# Altium project Controller-RK3562.PrjPcb (part 1 of 8)
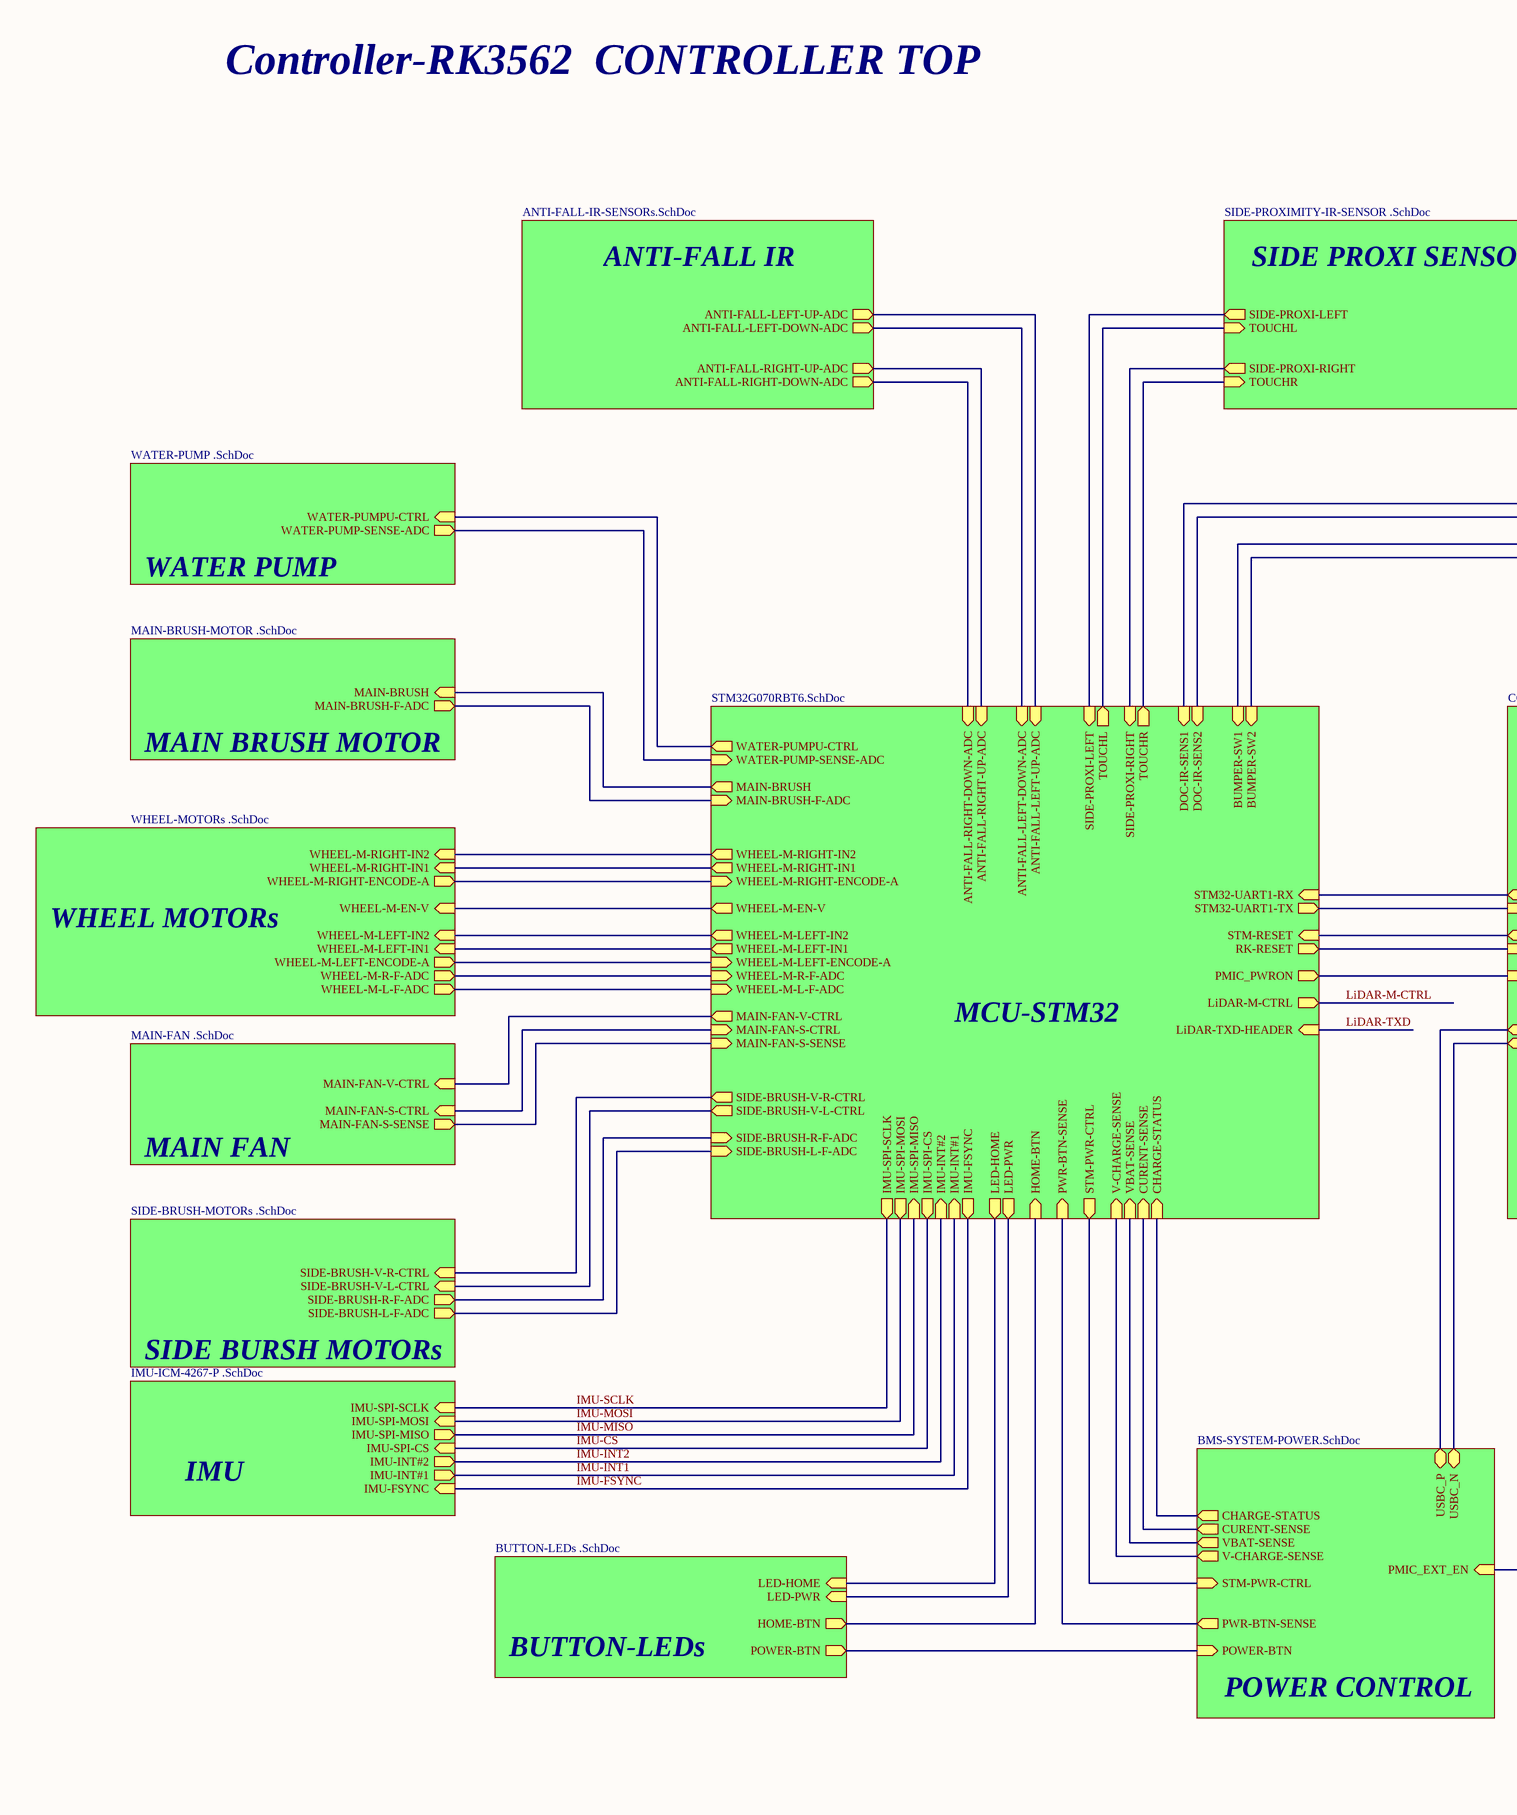
[diagram p0: Controller-RK3562-TOP.SchDoc, left]
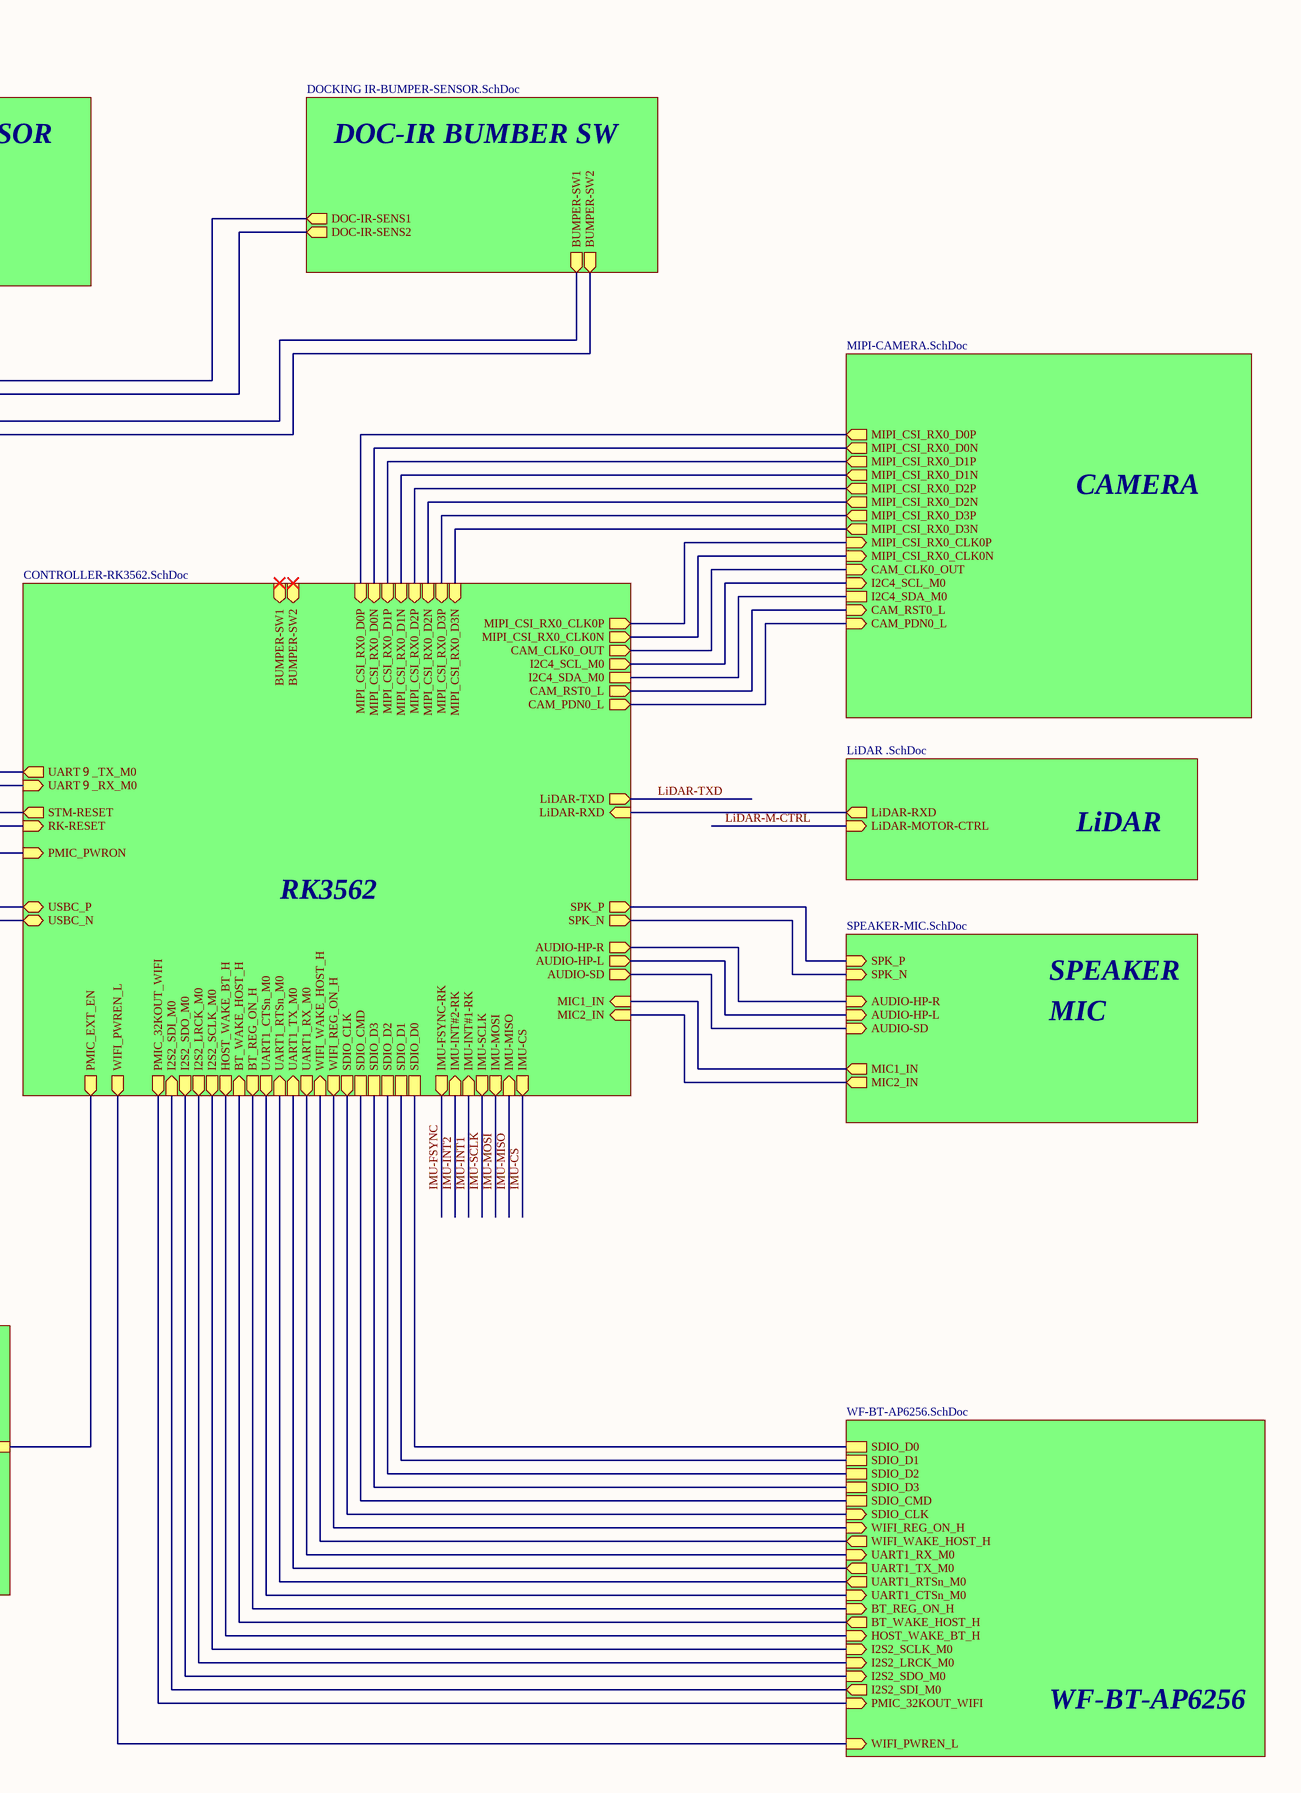
[diagram p1: Controller-RK3562-TOP.SchDoc, right]
32 sheets, 693 parts. Net scope: hierarchical (ports join the sheet entries above them; power ports are global).
Board file: Controller-RK3562-PCB.PcbDoc
Sheets:
  Controller-RK3562-TOP.SchDoc
    RK3562 = CONTROLLER-RK3562.SchDoc
      eMMC = eMMC.SchDoc
      RK3562-POWER = RK3562-POWER-GND.SchDoc
      RK3562-DDR-PHY = RK3562-DDR-PHY.SchDoc
      RK3562-PMUIO-OSC-PLL = RK3562-PMUIO-OSC-PLL.SchDoc
      RK3562-VCCIO1 = RK3562-VCCIO1.SchDoc
      RK3562-VCCIO2-VCCIO3 = RK3562-VCCIO2-VCCIO3.SchDoc
      RK3562-VCCIO4 = RK3562-VCCIO4.SchDoc
      RK3562-VCCIO5 = RK3562-VCCIO5.SchDoc
      RK3562-VCCIO6 = RK3562-VCCIO6.SchDoc
      RK3562-USB-PCIe-PHY = RK3562-USB-PCIe-PHY.SchDoc
      DRAM-LPDDR4 = DDR-LPDDR4.SchDoc
      SD/TF CARD = SD_TF-CARD.SchDoc
      RK-POWER-SUPPLY = RK-POWER-SUPPLY.SchDoc
      RK-PERIPHERAL-POWER = RK-PERIPHERAL-POWER.SchDoc
    POWER = BMS-SYSTEM-POWER.SchDoc
    DOCKING-BUMBER = DOCKING IR-BUMPER-SENSOR.SchDoc
    ANTI-FALL = ANTI-FALL-IR-SENSORs.SchDoc
    SIDE-PROXI = SIDE-PROXIMITY-IR-SENSOR .SchDoc
    WATER-PUMP = WATER-PUMP .SchDoc
    MAIN-BRUSH MOTOR = MAIN-BRUSH-MOTOR .SchDoc
    WHEEL MOTOR = WHEEL-MOTORs .SchDoc
    MAIN-FAN = MAIN-FAN .SchDoc
    SIDE-BRUSH = SIDE-BRUSH-MOTORs .SchDoc
    LiDAR = LiDAR .SchDoc
    SPEAKER-MIC = SPEAKER-MIC.SchDoc
    BUTTON-LED = BUTTON-LEDs .SchDoc
    CAMERA = MIPI-CAMERA.SchDoc
    MCU-STM32 = STM32G070RBT6.SchDoc
    WIFI-BT = WF-BT-AP6256.SchDoc
    IMU = IMU-ICM-4267-P .SchDoc

## Sheet Controller-RK3562-TOP.SchDoc
size A2; SheetNumber: 1; SheetTotal: 32

### Sub-sheets
ANTI-FALL = ANTI-FALL-IR-SENSORs.SchDoc: ANTI-FALL-LEFT-UP-ADC (out), ANTI-FALL-LEFT-DOWN-ADC (out), ANTI-FALL-RIGHT-UP-ADC (out), ANTI-FALL-RIGHT-DOWN-ADC (out)
BUTTON-LED = BUTTON-LEDs .SchDoc: LED-HOME (in), LED-PWR (in), HOME-BTN (out), POWER-BTN (out)
CAMERA = MIPI-CAMERA.SchDoc: MIPI_CSI_RX0_D0P (out), MIPI_CSI_RX0_D0N (out), MIPI_CSI_RX0_D1P (out), MIPI_CSI_RX0_D1N (out), MIPI_CSI_RX0_D2P (out), MIPI_CSI_RX0_D2N (out), MIPI_CSI_RX0_D3P (out), MIPI_CSI_RX0_D3N (out), CAM_CLK0_OUT (in), I2C4_SCL_M0 (in), I2C4_SDA_M0, CAM_RST0_L (in), CAM_PDN0_L (in), MIPI_CSI_RX0_CLK0P (in), MIPI_CSI_RX0_CLK0N (in)
DOCKING-BUMBER = DOCKING IR-BUMPER-SENSOR.SchDoc: DOC-IR-SENS1 (out), DOC-IR-SENS2 (out), BUMPER-SW1 (out), BUMPER-SW2 (out)
IMU = IMU-ICM-4267-P .SchDoc: IMU-SPI-SCLK (in), IMU-SPI-MOSI (in), IMU-SPI-MISO (out), IMU-SPI-CS (in), IMU-INT#2 (out), IMU-INT#1 (out), IMU-FSYNC (in)
LiDAR = LiDAR .SchDoc: LiDAR-MOTOR-CTRL (in), LiDAR-RXD (out)
MAIN-BRUSH MOTOR = MAIN-BRUSH-MOTOR .SchDoc: MAIN-BRUSH (in), MAIN-BRUSH-F-ADC (out)
MAIN-FAN = MAIN-FAN .SchDoc: MAIN-FAN-V-CTRL (in), MAIN-FAN-S-CTRL (in), MAIN-FAN-S-SENSE (out)
MCU-STM32 = STM32G070RBT6.SchDoc: WATER-PUMPU-CTRL (out), MAIN-BRUSH (out), WHEEL-M-RIGHT-IN2 (out), WHEEL-M-RIGHT-IN1 (out), WHEEL-M-RIGHT-ENCODE-A (in), WHEEL-M-LEFT-IN2 (out), WHEEL-M-LEFT-IN1 (out), WHEEL-M-LEFT-ENCODE-A (in), WHEEL-M-EN-V (out), MAIN-FAN-V-CTRL (out), MAIN-FAN-S-CTRL (in), MAIN-FAN-S-SENSE (in), SIDE-BRUSH-V-R-CTRL (out), SIDE-BRUSH-V-L-CTRL (out), DOC-IR-SENS1 (in), DOC-IR-SENS2 (in), ANTI-FALL-LEFT-UP-ADC (in), ANTI-FALL-LEFT-DOWN-ADC (in), ANTI-FALL-RIGHT-UP-ADC (in), ANTI-FALL-RIGHT-DOWN-ADC (in), SIDE-PROXI-LEFT (in), TOUCHL (out), SIDE-PROXI-RIGHT (in), TOUCHR (out), LED-HOME (out), LED-PWR (out), HOME-BTN (in), CHARGE-STATUS (in), CURENT-SENSE (in), VBAT-SENSE (in), STM-RESET (in), STM32-UART1-TX (out), STM32-UART1-RX (in), WATER-PUMP-SENSE-ADC (in), MAIN-BRUSH-F-ADC (in), WHEEL-M-R-F-ADC (in), WHEEL-M-L-F-ADC (in), SIDE-BRUSH-R-F-ADC (in), SIDE-BRUSH-L-F-ADC (in), STM-PWR-CTRL (out), PWR-BTN-SENSE (in), PMIC_PWRON (out), RK-RESET (out), V-CHARGE-SENSE (in), LiDAR-M-CTRL (out), IMU-SPI-SCLK (out), IMU-SPI-MOSI (out), IMU-SPI-MISO (in), IMU-SPI-CS (out), IMU-INT#2 (in), IMU-INT#1 (in), IMU-FSYNC (out), LiDAR-TXD-HEADER (in), BUMPER-SW1 (in), BUMPER-SW2 (in)
POWER = BMS-SYSTEM-POWER.SchDoc: CHARGE-STATUS (out), CURENT-SENSE (out), VBAT-SENSE (out), POWER-BTN (in), USBC_P (bidir), USBC_N (bidir), PMIC_EXT_EN (in), STM-PWR-CTRL (in), PWR-BTN-SENSE (out), V-CHARGE-SENSE (out)
RK3562 = CONTROLLER-RK3562.SchDoc: MIPI_CSI_RX0_CLK0P (out), MIPI_CSI_RX0_CLK0N (out), I2C4_SCL_M0 (out), I2C4_SDA_M0, CAM_RST0_L (out), CAM_PDN0_L (out), MIPI_CSI_RX0_D3N (in), MIPI_CSI_RX0_D3P (in), MIPI_CSI_RX0_D2N (in), MIPI_CSI_RX0_D2P (in), MIPI_CSI_RX0_D1N (in), MIPI_CSI_RX0_D1P (in), MIPI_CSI_RX0_D0N (in), MIPI_CSI_RX0_D0P (in), CAM_CLK0_OUT (out), LiDAR-RXD (in), AUDIO-HP-L (out), AUDIO-SD (out), MIC1_IN (in), MIC2_IN (in), IMU-INT#1-RK (in), IMU-INT#2-RK (in), IMU-FSYNC-RK (out), SDIO_D0, SDIO_D1, SDIO_D2, SDIO_D3, SDIO_CMD, SDIO_CLK (out), WIFI_REG_ON_H (out), WIFI_WAKE_HOST_H (in), UART1_RX_M0 (out), UART1_TX_M0 (in), UART1_RTSn_M0 (in), UART1_CTSn_M0 (out), BT_REG_ON_H (out), BT_WAKE_HOST_H (in), HOST_WAKE_BT_H (out), I2S2_SCLK_M0 (out), I2S2_LRCK_M0 (out), I2S2_SDO_M0 (out), I2S2_SDI_M0 (in), PMIC_32KOUT_WIFI (out), WIFI_PWREN_L (out), PMIC_EXT_EN (out), PMIC_PWRON (in), USBC_N (bidir), USBC_P (bidir), UART９_RX_M0 (in), UART９_TX_M0 (out), STM-RESET (out), RK-RESET (in), BUMPER-SW1 (in), BUMPER-SW2 (in), IMU-SCLK (out), IMU-MOSI (out), IMU-MISO (in), IMU-CS (out), LiDAR-TXD (out), AUDIO-HP-R (out), SPK_P (out), SPK_N (out)
SIDE-BRUSH = SIDE-BRUSH-MOTORs .SchDoc: SIDE-BRUSH-V-R-CTRL (in), SIDE-BRUSH-V-L-CTRL (in), SIDE-BRUSH-R-F-ADC (out), SIDE-BRUSH-L-F-ADC (out)
SIDE-PROXI = SIDE-PROXIMITY-IR-SENSOR .SchDoc: SIDE-PROXI-LEFT (out), TOUCHL (in), SIDE-PROXI-RIGHT (out), TOUCHR (in)
SPEAKER-MIC = SPEAKER-MIC.SchDoc: AUDIO-HP-L (in), AUDIO-SD (in), MIC1_IN (out), MIC2_IN (out), AUDIO-HP-R (in), SPK_P (in), SPK_N (in)
WATER-PUMP = WATER-PUMP .SchDoc: WATER-PUMPU-CTRL (in), WATER-PUMP-SENSE-ADC (out)
WHEEL MOTOR = WHEEL-MOTORs .SchDoc: WHEEL-M-RIGHT-IN2 (in), WHEEL-M-RIGHT-IN1 (in), WHEEL-M-RIGHT-ENCODE-A (out), WHEEL-M-EN-V (in), WHEEL-M-LEFT-IN2 (in), WHEEL-M-LEFT-IN1 (in), WHEEL-M-LEFT-ENCODE-A (out), WHEEL-M-R-F-ADC (out), WHEEL-M-L-F-ADC (out)
WIFI-BT = WF-BT-AP6256.SchDoc: SDIO_D0, SDIO_D1, SDIO_D2, SDIO_D3, SDIO_CMD, SDIO_CLK (in), WIFI_REG_ON_H (in), WIFI_WAKE_HOST_H (out), UART1_RX_M0 (in), UART1_TX_M0 (out), UART1_RTSn_M0 (out), UART1_CTSn_M0 (in), BT_REG_ON_H (in), BT_WAKE_HOST_H (out), HOST_WAKE_BT_H (in), I2S2_SCLK_M0 (in), I2S2_LRCK_M0 (in), I2S2_SDO_M0 (in), I2S2_SDI_M0 (out), PMIC_32KOUT_WIFI (in), WIFI_PWREN_L (in)

### Nets
BT_REG_ON_H: sheet RK3562/BT_REG_ON_H, sheet WIFI-BT/BT_REG_ON_H
BT_WAKE_HOST_H: sheet RK3562/BT_WAKE_HOST_H, sheet WIFI-BT/BT_WAKE_HOST_H
CAM_CLK0_OUT: sheet RK3562/CAM_CLK0_OUT, sheet CAMERA/CAM_CLK0_OUT
CAM_PDN0_L: sheet RK3562/CAM_PDN0_L, sheet CAMERA/CAM_PDN0_L
CAM_RST0_L: sheet RK3562/CAM_RST0_L, sheet CAMERA/CAM_RST0_L
HOST_WAKE_BT_H: sheet RK3562/HOST_WAKE_BT_H, sheet WIFI-BT/HOST_WAKE_BT_H
HPL_OUT: sheet RK3562/AUDIO-HP-L, sheet SPEAKER-MIC/AUDIO-HP-L
HPR_OUT: sheet RK3562/AUDIO-HP-R, sheet SPEAKER-MIC/AUDIO-HP-R
I2C4_SCL_M0: sheet RK3562/I2C4_SCL_M0, sheet CAMERA/I2C4_SCL_M0
I2C4_SDA_M0: sheet RK3562/I2C4_SDA_M0, sheet CAMERA/I2C4_SDA_M0
I2S2_LRCK_M0: sheet RK3562/I2S2_LRCK_M0, sheet WIFI-BT/I2S2_LRCK_M0
I2S2_SCLK_M0: sheet RK3562/I2S2_SCLK_M0, sheet WIFI-BT/I2S2_SCLK_M0
I2S2_SDI_M0: sheet RK3562/I2S2_SDI_M0, sheet WIFI-BT/I2S2_SDI_M0
I2S2_SDO_M0: sheet RK3562/I2S2_SDO_M0, sheet WIFI-BT/I2S2_SDO_M0
IMU-CS: sheet RK3562/IMU-CS, sheet MCU-STM32/IMU-SPI-CS, sheet IMU/IMU-SPI-CS
IMU-FSYNC: sheet RK3562/IMU-FSYNC-RK, sheet MCU-STM32/IMU-FSYNC, sheet IMU/IMU-FSYNC
IMU-INT1: sheet RK3562/IMU-INT#1-RK, sheet MCU-STM32/IMU-INT#1, sheet IMU/IMU-INT#1
IMU-INT2: sheet RK3562/IMU-INT#2-RK, sheet MCU-STM32/IMU-INT#2, sheet IMU/IMU-INT#2
IMU-MISO: sheet RK3562/IMU-MISO, sheet MCU-STM32/IMU-SPI-MISO, sheet IMU/IMU-SPI-MISO
IMU-MOSI: sheet RK3562/IMU-MOSI, sheet MCU-STM32/IMU-SPI-MOSI, sheet IMU/IMU-SPI-MOSI
IMU-SCLK: sheet RK3562/IMU-SCLK, sheet MCU-STM32/IMU-SPI-SCLK, sheet IMU/IMU-SPI-SCLK
LiDAR-M-CTRL: sheet LiDAR/LiDAR-MOTOR-CTRL, sheet MCU-STM32/LiDAR-M-CTRL
LiDAR-TXD: sheet RK3562/LiDAR-TXD, sheet MCU-STM32/LiDAR-TXD-HEADER
MIC1_IN: sheet RK3562/MIC1_IN, sheet SPEAKER-MIC/MIC1_IN
MIC2_IN: sheet RK3562/MIC2_IN, sheet SPEAKER-MIC/MIC2_IN
MIPI_CSI_RX0_CLK0_N: sheet RK3562/MIPI_CSI_RX0_CLK0N, sheet CAMERA/MIPI_CSI_RX0_CLK0N
MIPI_CSI_RX0_CLK0_P: sheet RK3562/MIPI_CSI_RX0_CLK0P, sheet CAMERA/MIPI_CSI_RX0_CLK0P
MIPI_CSI_RX0_D0_N: sheet RK3562/MIPI_CSI_RX0_D0N, sheet CAMERA/MIPI_CSI_RX0_D0N
MIPI_CSI_RX0_D0_P: sheet RK3562/MIPI_CSI_RX0_D0P, sheet CAMERA/MIPI_CSI_RX0_D0P
MIPI_CSI_RX0_D1_N: sheet RK3562/MIPI_CSI_RX0_D1N, sheet CAMERA/MIPI_CSI_RX0_D1N
MIPI_CSI_RX0_D1_P: sheet RK3562/MIPI_CSI_RX0_D1P, sheet CAMERA/MIPI_CSI_RX0_D1P
MIPI_CSI_RX0_D2_N: sheet RK3562/MIPI_CSI_RX0_D2N, sheet CAMERA/MIPI_CSI_RX0_D2N
MIPI_CSI_RX0_D2_P: sheet RK3562/MIPI_CSI_RX0_D2P, sheet CAMERA/MIPI_CSI_RX0_D2P
MIPI_CSI_RX0_D3_N: sheet RK3562/MIPI_CSI_RX0_D3N, sheet CAMERA/MIPI_CSI_RX0_D3N
MIPI_CSI_RX0_D3_P: sheet RK3562/MIPI_CSI_RX0_D3P, sheet CAMERA/MIPI_CSI_RX0_D3P
PC3: sheet DOCKING-BUMBER/BUMPER-SW1, sheet MCU-STM32/BUMPER-SW1
PC13: sheet DOCKING-BUMBER/BUMPER-SW2, sheet MCU-STM32/BUMPER-SW2
PMIC_32KOUT_WIFI: sheet RK3562/PMIC_32KOUT_WIFI, sheet WIFI-BT/PMIC_32KOUT_WIFI
PMIC_EXT_EN: sheet RK3562/PMIC_EXT_EN, sheet POWER/PMIC_EXT_EN
PMIC_PWRON: sheet RK3562/PMIC_PWRON, sheet MCU-STM32/PMIC_PWRON
RESETn: sheet RK3562/RK-RESET, sheet MCU-STM32/RK-RESET
SDIO_CLK: sheet RK3562/SDIO_CLK, sheet WIFI-BT/SDIO_CLK
SDIO_CMD: sheet RK3562/SDIO_CMD, sheet WIFI-BT/SDIO_CMD
SDIO_D0: sheet RK3562/SDIO_D0, sheet WIFI-BT/SDIO_D0
SDIO_D1: sheet RK3562/SDIO_D1, sheet WIFI-BT/SDIO_D1
SDIO_D2: sheet RK3562/SDIO_D2, sheet WIFI-BT/SDIO_D2
SDIO_D3: sheet RK3562/SDIO_D3, sheet WIFI-BT/SDIO_D3
SPKN_OUT: sheet RK3562/SPK_N, sheet SPEAKER-MIC/SPK_N
SPKP_OUT: sheet RK3562/SPK_P, sheet SPEAKER-MIC/SPK_P
STM32-RST: sheet RK3562/STM-RESET, sheet MCU-STM32/STM-RESET
UART1_CTSn_M0: sheet RK3562/UART1_CTSn_M0, sheet WIFI-BT/UART1_CTSn_M0
UART1_RTSn_M0: sheet RK3562/UART1_RTSn_M0, sheet WIFI-BT/UART1_RTSn_M0
UART1_RX_M0: sheet RK3562/UART1_RX_M0, sheet WIFI-BT/UART1_RX_M0
UART1_TX_M0: sheet RK3562/UART1_TX_M0, sheet WIFI-BT/UART1_TX_M0
UART4_RXD_M0: sheet RK3562/LiDAR-RXD, sheet LiDAR/LiDAR-RXD
UART9_RXD_M0: sheet RK3562/UART９_RX_M0, sheet MCU-STM32/STM32-UART1-TX
UART9_TXD_M0: sheet RK3562/UART９_TX_M0, sheet MCU-STM32/STM32-UART1-RX
WIFI_PWREN_L: sheet RK3562/WIFI_PWREN_L, sheet WIFI-BT/WIFI_PWREN_L
WIFI_REG_ON_H: sheet RK3562/WIFI_REG_ON_H, sheet WIFI-BT/WIFI_REG_ON_H
WIFI_WAKE_HOST_H: sheet RK3562/WIFI_WAKE_HOST_H, sheet WIFI-BT/WIFI_WAKE_HOST_H
NetC92_1: sheet MAIN-FAN/MAIN-FAN-S-SENSE, sheet MCU-STM32/MAIN-FAN-S-SENSE
NetD17_1: sheet WATER-PUMP/WATER-PUMP-SENSE-ADC, sheet MCU-STM32/WATER-PUMP-SENSE-ADC
NetD18_1: sheet MAIN-BRUSH MOTOR/MAIN-BRUSH-F-ADC, sheet MCU-STM32/MAIN-BRUSH-F-ADC
NetD19_1: sheet WHEEL MOTOR/WHEEL-M-R-F-ADC, sheet MCU-STM32/WHEEL-M-R-F-ADC
NetD20_1: sheet WHEEL MOTOR/WHEEL-M-L-F-ADC, sheet MCU-STM32/WHEEL-M-L-F-ADC
NetD21_1: sheet SIDE-BRUSH/SIDE-BRUSH-R-F-ADC, sheet MCU-STM32/SIDE-BRUSH-R-F-ADC
NetD22_1: sheet SIDE-BRUSH/SIDE-BRUSH-L-F-ADC, sheet MCU-STM32/SIDE-BRUSH-L-F-ADC
NetD25_1: sheet POWER/PWR-BTN-SENSE, sheet MCU-STM32/PWR-BTN-SENSE
NetD25_2: sheet POWER/POWER-BTN, sheet BUTTON-LED/POWER-BTN
NetIR1_1: sheet DOCKING-BUMBER/DOC-IR-SENS1, sheet MCU-STM32/DOC-IR-SENS1
NetIR2_1: sheet DOCKING-BUMBER/DOC-IR-SENS2, sheet MCU-STM32/DOC-IR-SENS2
NetJ2_3: sheet RK3562/USBC_P, sheet POWER/USBC_P
NetJ2_4: sheet RK3562/USBC_N, sheet POWER/USBC_N
NetJ4_4: sheet ANTI-FALL/ANTI-FALL-LEFT-UP-ADC, sheet MCU-STM32/ANTI-FALL-LEFT-UP-ADC
NetJ4_8: sheet ANTI-FALL/ANTI-FALL-LEFT-DOWN-ADC, sheet MCU-STM32/ANTI-FALL-LEFT-DOWN-ADC
NetJ5_4: sheet ANTI-FALL/ANTI-FALL-RIGHT-UP-ADC, sheet MCU-STM32/ANTI-FALL-RIGHT-UP-ADC
NetJ5_8: sheet ANTI-FALL/ANTI-FALL-RIGHT-DOWN-ADC, sheet MCU-STM32/ANTI-FALL-RIGHT-DOWN-ADC
NetJ8_1: sheet SIDE-PROXI/SIDE-PROXI-LEFT, sheet MCU-STM32/SIDE-PROXI-LEFT
NetJ9_1: sheet SIDE-PROXI/SIDE-PROXI-RIGHT, sheet MCU-STM32/SIDE-PROXI-RIGHT
NetK2_3: sheet BUTTON-LED/HOME-BTN, sheet MCU-STM32/HOME-BTN
NetQ10_1: sheet MAIN-BRUSH MOTOR/MAIN-BRUSH, sheet MCU-STM32/MAIN-BRUSH
NetQ16_1: sheet SIDE-BRUSH/SIDE-BRUSH-V-R-CTRL, sheet MCU-STM32/SIDE-BRUSH-V-R-CTRL
NetQ18_1: sheet SIDE-BRUSH/SIDE-BRUSH-V-L-CTRL, sheet MCU-STM32/SIDE-BRUSH-V-L-CTRL
NetR5_1: sheet POWER/CHARGE-STATUS, sheet MCU-STM32/CHARGE-STATUS
NetR9_1: sheet POWER/V-CHARGE-SENSE, sheet MCU-STM32/V-CHARGE-SENSE
NetR27_2: sheet WATER-PUMP/WATER-PUMPU-CTRL, sheet MCU-STM32/WATER-PUMPU-CTRL
NetR28_2: sheet POWER/STM-PWR-CTRL, sheet MCU-STM32/STM-PWR-CTRL
NetR30_2: sheet POWER/VBAT-SENSE, sheet MCU-STM32/VBAT-SENSE
NetR77_1: sheet SIDE-PROXI/TOUCHL, sheet MCU-STM32/TOUCHL
NetR80_1: sheet SIDE-PROXI/TOUCHR, sheet MCU-STM32/TOUCHR
NetR89_1: sheet WHEEL MOTOR/WHEEL-M-RIGHT-IN2, sheet MCU-STM32/WHEEL-M-RIGHT-IN2
NetR90_1: sheet WHEEL MOTOR/WHEEL-M-RIGHT-IN1, sheet MCU-STM32/WHEEL-M-RIGHT-IN1
NetR91_2: sheet WHEEL MOTOR/WHEEL-M-EN-V, sheet MCU-STM32/WHEEL-M-EN-V
NetR95_1: sheet WHEEL MOTOR/WHEEL-M-RIGHT-ENCODE-A, sheet MCU-STM32/WHEEL-M-RIGHT-ENCODE-A
NetR97_1: sheet WHEEL MOTOR/WHEEL-M-LEFT-IN2, sheet MCU-STM32/WHEEL-M-LEFT-IN2
NetR98_1: sheet WHEEL MOTOR/WHEEL-M-LEFT-IN1, sheet MCU-STM32/WHEEL-M-LEFT-IN1
NetR102_1: sheet WHEEL MOTOR/WHEEL-M-LEFT-ENCODE-A, sheet MCU-STM32/WHEEL-M-LEFT-ENCODE-A
NetR104_1: sheet MAIN-FAN/MAIN-FAN-V-CTRL, sheet MCU-STM32/MAIN-FAN-V-CTRL
NetR105_2: sheet MAIN-FAN/MAIN-FAN-S-CTRL, sheet MCU-STM32/MAIN-FAN-S-CTRL
NetR123_2: sheet BUTTON-LED/LED-HOME, sheet MCU-STM32/LED-HOME
NetR126_2: sheet BUTTON-LED/LED-PWR, sheet MCU-STM32/LED-PWR
NetU6_1: sheet POWER/CURENT-SENSE, sheet MCU-STM32/CURENT-SENSE
NetU1000_AB3: sheet RK3562/AUDIO-SD, sheet SPEAKER-MIC/AUDIO-SD

### Notes on the sheet
- Controller-RK3562  CONTROLLER TOP
- ANTI-FALL IR
- SIDE PROXI SENSOR
- DOC-IR BUMBER SW
- WATER PUMP
- CAMERA
- MAIN BRUSH MOTOR
- WHEEL MOTORs
- LiDAR
- MCU-STM32
- RK3562
- MAIN FAN
- SPEAKER
- MIC
- SIDE BURSH MOTORs
- IMU
- BUTTON-LEDs
- POWER CONTROL
- WF-BT-AP6256

## Sheet CONTROLLER-RK3562.SchDoc
size A2; SheetNumber: 3; SheetTotal: 32
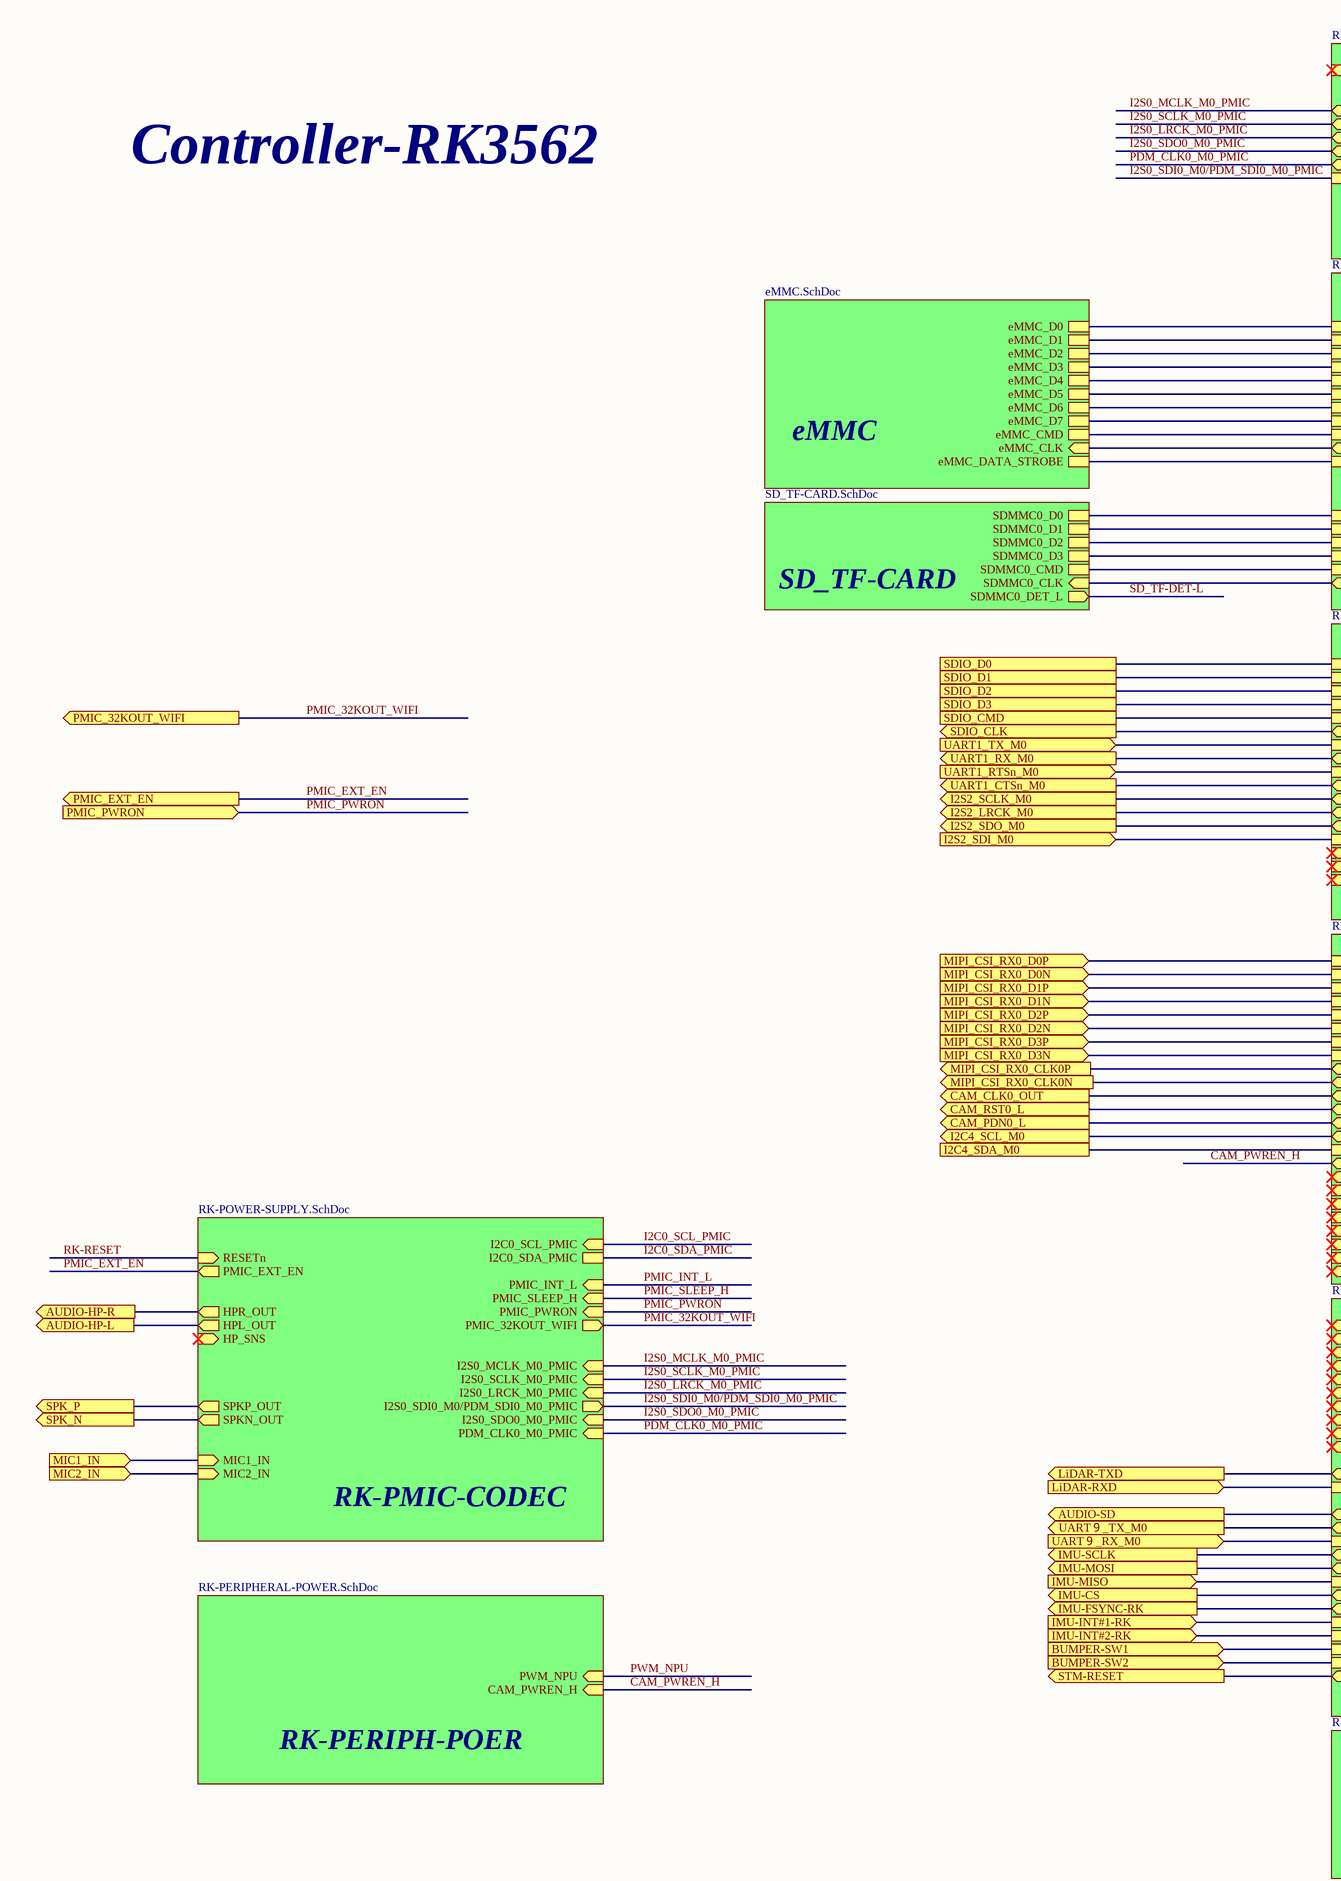
[diagram p2: CONTROLLER-RK3562.SchDoc, left]
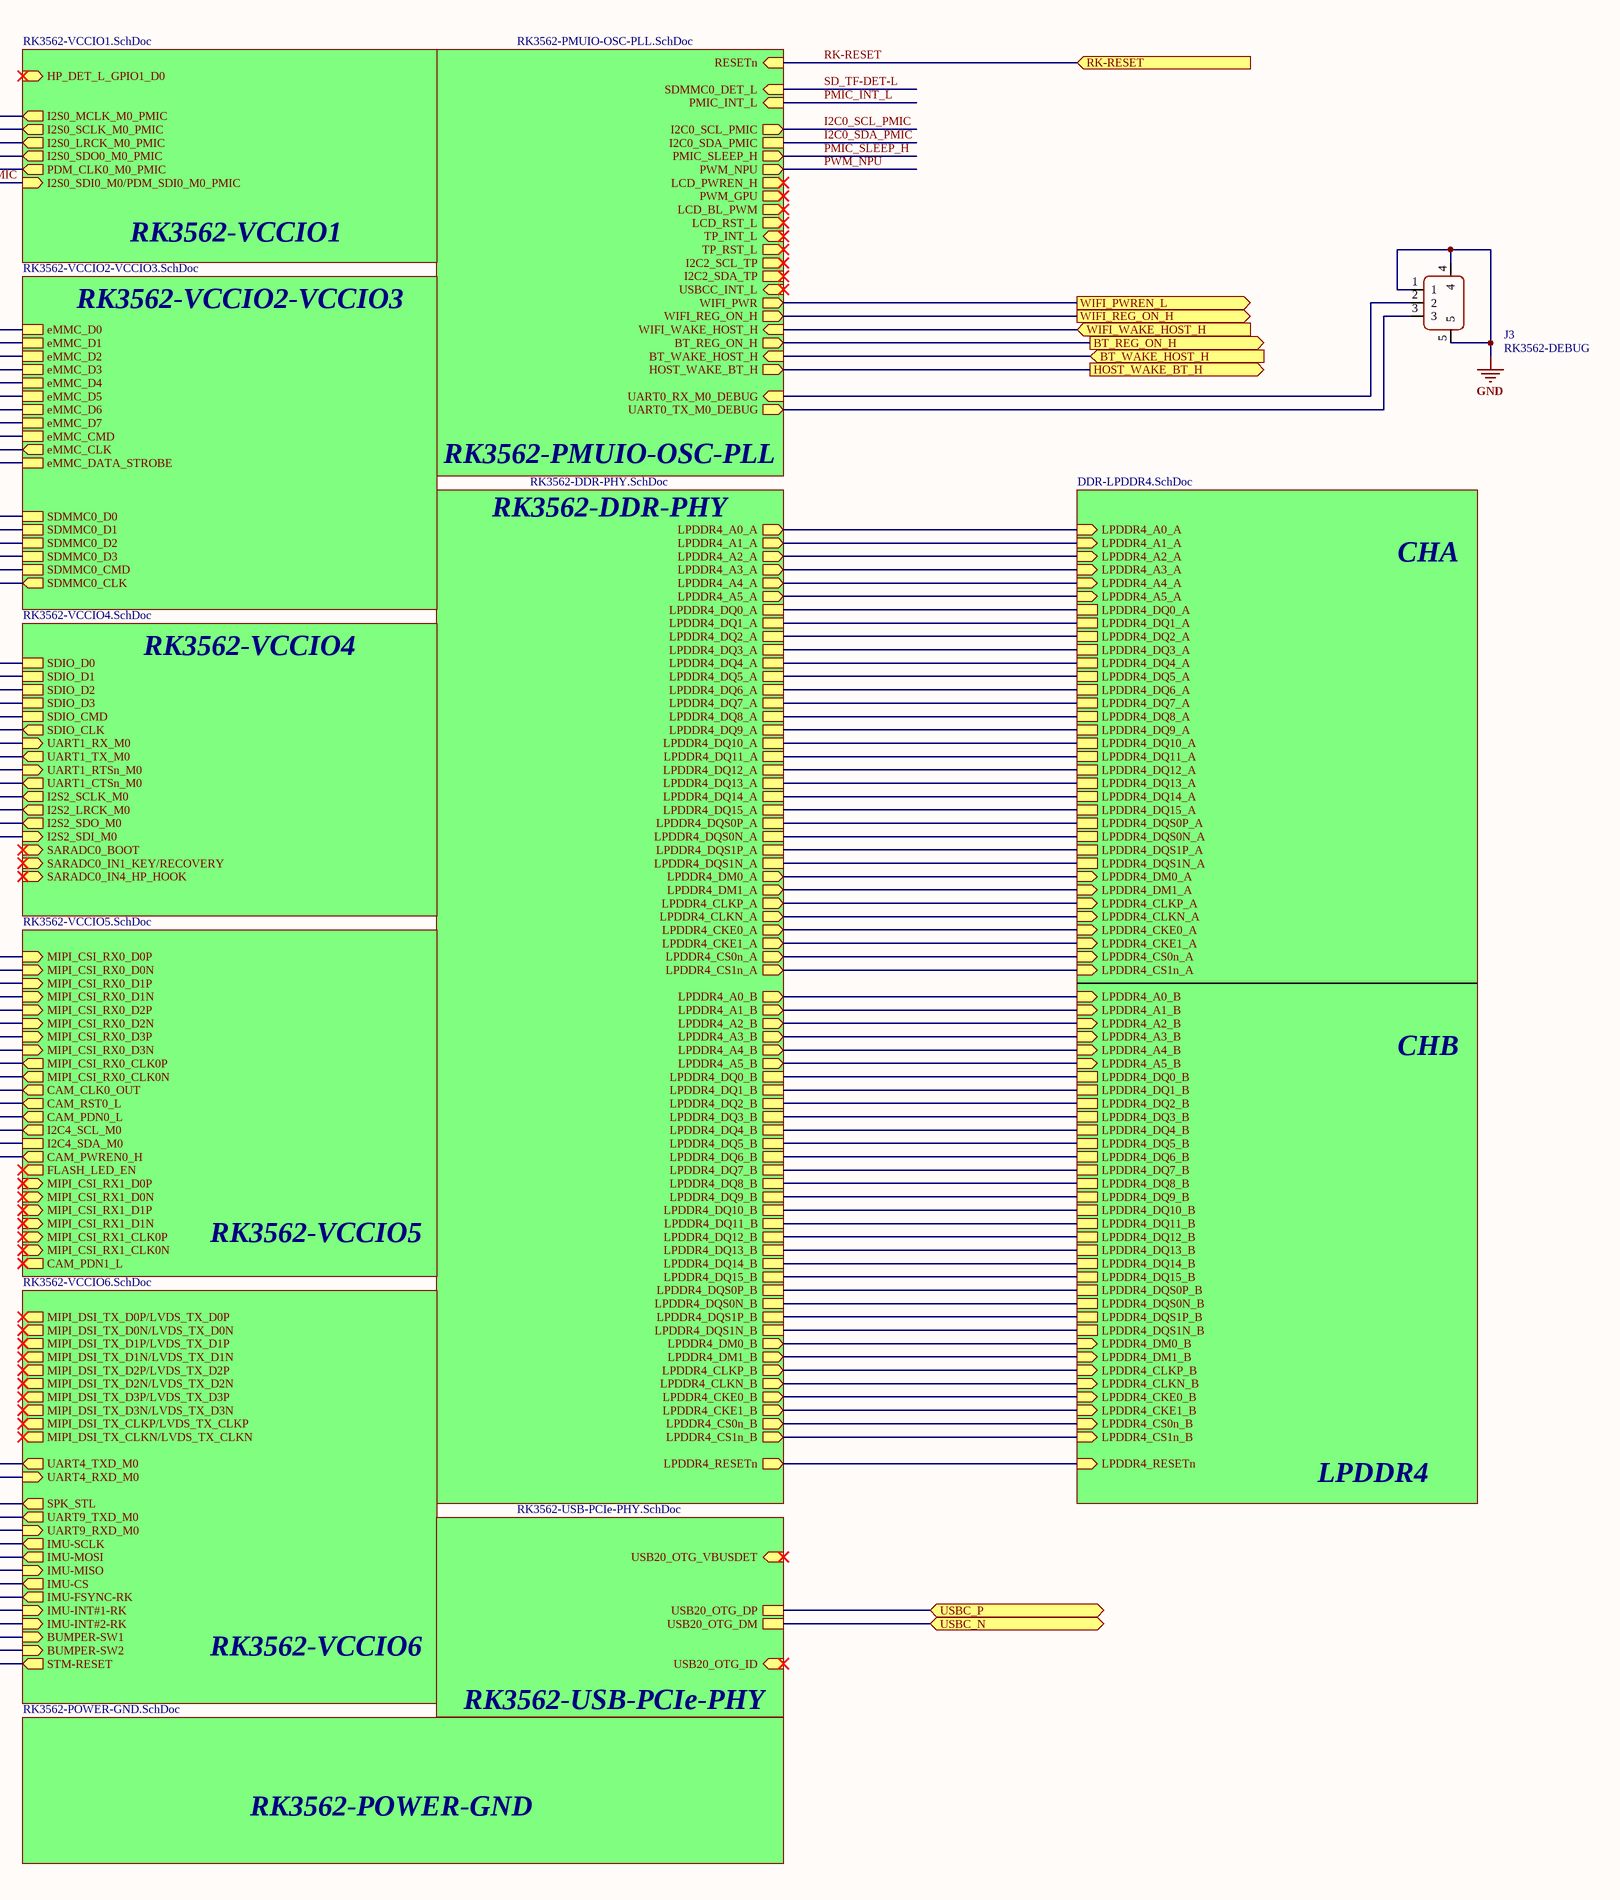
[diagram p3: CONTROLLER-RK3562.SchDoc, right]

### Parts
J3  RK3562-DEBUG  [MHDR1X3]

### Sub-sheets
DRAM-LPDDR4 = DDR-LPDDR4.SchDoc: LPDDR4_DQ0_B, LPDDR4_DQ0_A, LPDDR4_DQ1_B, LPDDR4_DQ1_A, LPDDR4_DQ2_B, LPDDR4_DQ2_A, LPDDR4_DQ3_B, LPDDR4_DQ3_A, LPDDR4_DQ4_A, LPDDR4_DQ4_B, LPDDR4_DQ5_A, LPDDR4_DQ5_B, LPDDR4_DQ6_A, LPDDR4_DQ6_B, LPDDR4_DQ7_B, LPDDR4_DQ7_A, LPDDR4_DQS0P_B, LPDDR4_DQS0P_A, LPDDR4_DQS0N_A, LPDDR4_DQS0N_B, LPDDR4_DM0_B (in), LPDDR4_DQ8_B, LPDDR4_DQ8_A, LPDDR4_DQ9_B, LPDDR4_DQ9_A, LPDDR4_DQ10_B, LPDDR4_DQ10_A, LPDDR4_DQ11_A, LPDDR4_DQ11_B, LPDDR4_DQ12_A, LPDDR4_DQ12_B, LPDDR4_DQ13_B, LPDDR4_DQ13_A, LPDDR4_DQ14_B, LPDDR4_DQ14_A, LPDDR4_DQ15_B, LPDDR4_DQ15_A, LPDDR4_DQS1P_A, LPDDR4_DQS1P_B, LPDDR4_DQS1N_B, LPDDR4_DQS1N_A, LPDDR4_DM1_B (in), LPDDR4_A0_A (in), LPDDR4_A0_B (in), LPDDR4_A1_B (in), LPDDR4_A1_A (in), LPDDR4_A2_A (in), LPDDR4_A2_B (in), LPDDR4_A3_B (in), LPDDR4_A3_A (in), LPDDR4_A4_B (in), LPDDR4_A4_A (in), LPDDR4_A5_B (in), LPDDR4_A5_A (in), LPDDR4_CLKP_B (in), LPDDR4_CLKP_A (in), LPDDR4_CLKN_B (in), LPDDR4_CLKN_A (in), LPDDR4_CKE0_B (in), LPDDR4_CKE0_A (in), LPDDR4_CKE1_A (in), LPDDR4_CKE1_B (in), LPDDR4_CS0n_A (in), LPDDR4_CS0n_B (in), LPDDR4_CS1n_A (in), LPDDR4_CS1n_B (in), LPDDR4_RESETn (in), LPDDR4_DM0_A (in), LPDDR4_DM1_A (in)
eMMC = eMMC.SchDoc: eMMC_D0, eMMC_D1, eMMC_D2, eMMC_D3, eMMC_D4, eMMC_D5, eMMC_D6, eMMC_D7, eMMC_CMD, eMMC_DATA_STROBE, eMMC_CLK (in)
RK3562-DDR-PHY = RK3562-DDR-PHY.SchDoc: LPDDR4_CLKN_B (out), LPDDR4_DQ0_A, LPDDR4_DQ1_A, LPDDR4_DQ2_A, LPDDR4_A1_A (out), LPDDR4_DQ3_A, LPDDR4_CS0n_A (out), LPDDR4_DQ4_A, LPDDR4_DQ5_A, LPDDR4_A3_B (out), LPDDR4_A5_B (out), LPDDR4_DQ6_A, LPDDR4_A1_B (out), LPDDR4_DQ7_A, LPDDR4_A0_B (out), LPDDR4_DM0_A (out), LPDDR4_DQS0P_A, LPDDR4_CLKP_B (out), LPDDR4_DQS0N_A, LPDDR4_CKE0_B (out), LPDDR4_A0_A (out), LPDDR4_DQ8_A, LPDDR4_A3_A (out), LPDDR4_DQ9_A, LPDDR4_DQ10_A, LPDDR4_A4_A (out), LPDDR4_DQ11_A, LPDDR4_A2_A (out), LPDDR4_DQ12_A, LPDDR4_DQ13_A, LPDDR4_A5_A (out), LPDDR4_DQ14_A, LPDDR4_CKE1_B (out), LPDDR4_DQ15_A, LPDDR4_A2_B (out), LPDDR4_A4_B (out), LPDDR4_DM1_A (out), LPDDR4_DQS1P_A, LPDDR4_CKE0_A (out), LPDDR4_DQS1N_A, LPDDR4_CLKN_A (out), LPDDR4_DQ0_B, LPDDR4_CLKP_A (out), LPDDR4_DQ1_B, LPDDR4_CKE1_A (out), LPDDR4_DQ2_B, LPDDR4_DQ3_B, LPDDR4_CS1n_A (out), LPDDR4_DQ4_B, LPDDR4_CS1n_B (out), LPDDR4_DQ5_B, LPDDR4_CS0n_B (out), LPDDR4_DQ6_B, LPDDR4_DQ7_B, LPDDR4_RESETn (out), LPDDR4_DM0_B (out), LPDDR4_DQS0P_B, LPDDR4_DQS0N_B, LPDDR4_DQ8_B, LPDDR4_DQ9_B, LPDDR4_DQ10_B, LPDDR4_DQ11_B, LPDDR4_DQ12_B, LPDDR4_DQ13_B, LPDDR4_DQ14_B, LPDDR4_DQ15_B, LPDDR4_DM1_B (out), LPDDR4_DQS1P_B, LPDDR4_DQS1N_B
RK3562-PMUIO-OSC-PLL = RK3562-PMUIO-OSC-PLL.SchDoc: RESETn (in), WIFI_PWR (out), PMIC_SLEEP_H (out), PMIC_INT_L (in), SDMMC0_DET_L (in), USBCC_INT_L (in), LCD_PWREN_H (out), I2C0_SCL_PMIC (out), I2C0_SDA_PMIC, WIFI_REG_ON_H (out), WIFI_WAKE_HOST_H (in), I2C2_SCL_TP (out), I2C2_SDA_TP, TP_RST_L (out), PWM_GPU (out), PWM_NPU (out), LCD_BL_PWM (out), TP_INT_L (in), LCD_RST_L (out), BT_REG_ON_H (out), BT_WAKE_HOST_H (in), HOST_WAKE_BT_H (out), UART0_RX_M0_DEBUG (in), UART0_TX_M0_DEBUG (out)
RK3562-POWER = RK3562-POWER-GND.SchDoc: no entries
RK3562-USB-PCIe-PHY = RK3562-USB-PCIe-PHY.SchDoc: USB20_OTG_DP, USB20_OTG_DM, USB20_OTG_VBUSDET (in), USB20_OTG_ID (in)
RK3562-VCCIO1 = RK3562-VCCIO1.SchDoc: HP_DET_L_GPIO1_D0 (in), I2S0_MCLK_M0_PMIC (out), I2S0_SCLK_M0_PMIC (out), I2S0_LRCK_M0_PMIC (out), I2S0_SDO0_M0_PMIC (out), PDM_CLK0_M0_PMIC (out), I2S0_SDI0_M0/PDM_SDI0_M0_PMIC (in)
RK3562-VCCIO2-VCCIO3 = RK3562-VCCIO2-VCCIO3.SchDoc: eMMC_D0, eMMC_D1, eMMC_D2, eMMC_D3, eMMC_D4, eMMC_D5, eMMC_D6, eMMC_D7, eMMC_CMD, eMMC_CLK (out), eMMC_DATA_STROBE, SDMMC0_D0, SDMMC0_D1, SDMMC0_D2, SDMMC0_D3, SDMMC0_CMD, SDMMC0_CLK (out)
RK3562-VCCIO4 = RK3562-VCCIO4.SchDoc: SDIO_D0, SDIO_D1, SDIO_D2, SDIO_D3, SDIO_CMD, SDIO_CLK (out), UART1_RX_M0 (in), UART1_TX_M0 (out), UART1_RTSn_M0 (in), UART1_CTSn_M0 (out), I2S2_SCLK_M0 (out), I2S2_LRCK_M0 (out), I2S2_SDO_M0 (out), I2S2_SDI_M0 (in), SARADC0_BOOT (in), SARADC0_IN1_KEY/RECOVERY (in), SARADC0_IN4_HP_HOOK (in)
RK3562-VCCIO5 = RK3562-VCCIO5.SchDoc: MIPI_CSI_RX0_D0P (in), MIPI_CSI_RX0_D0N (in), MIPI_CSI_RX0_D1P (in), MIPI_CSI_RX0_D1N (in), MIPI_CSI_RX0_D2P (in), MIPI_CSI_RX0_D2N (in), MIPI_CSI_RX0_D3P (in), MIPI_CSI_RX0_D3N (in), MIPI_CSI_RX1_D0P (in), MIPI_CSI_RX1_D0N (in), MIPI_CSI_RX1_D1P (in), MIPI_CSI_RX1_D1N (in), MIPI_CSI_RX1_CLK0P (in), MIPI_CSI_RX1_CLK0N (in), CAM_CLK0_OUT (out), CAM_PWREN0_H (out), CAM_PDN1_L (out), CAM_RST0_L (out), I2C4_SCL_M0 (out), I2C4_SDA_M0, CAM_PDN0_L (out), FLASH_LED_EN (out), MIPI_CSI_RX0_CLK0P (out), MIPI_CSI_RX0_CLK0N (out)
RK3562-VCCIO6 = RK3562-VCCIO6.SchDoc: MIPI_DSI_TX_D0P/LVDS_TX_D0P (out), MIPI_DSI_TX_D0N/LVDS_TX_D0N (out), MIPI_DSI_TX_D1P/LVDS_TX_D1P (out), MIPI_DSI_TX_D1N/LVDS_TX_D1N (out), MIPI_DSI_TX_D2P/LVDS_TX_D2P (out), MIPI_DSI_TX_D2N/LVDS_TX_D2N (out), MIPI_DSI_TX_D3P/LVDS_TX_D3P (out), MIPI_DSI_TX_D3N/LVDS_TX_D3N (out), MIPI_DSI_TX_CLKP/LVDS_TX_CLKP (out), MIPI_DSI_TX_CLKN/LVDS_TX_CLKN (out), UART4_TXD_M0 (out), UART4_RXD_M0 (in), SPK_STL (out), STM-RESET (out), BUMPER-SW1 (in), BUMPER-SW2 (in), IMU-SCLK (out), IMU-MOSI (out), IMU-MISO (in), IMU-CS (out), IMU-FSYNC-RK (out), IMU-INT#1-RK (in), IMU-INT#2-RK (in), UART9_TXD_M0 (out), UART9_RXD_M0 (in)
RK-PERIPHERAL-POWER = RK-PERIPHERAL-POWER.SchDoc: PWM_NPU (in), CAM_PWREN_H (in)
RK-POWER-SUPPLY = RK-POWER-SUPPLY.SchDoc: HPL_OUT (out), HP_SNS (in), I2C0_SDA_PMIC, HPR_OUT (out), PMIC_INT_L (in), SPKN_OUT (out), RESETn (in), SPKP_OUT (out), MIC1_IN (in), PMIC_32KOUT_WIFI (out), MIC2_IN (in), I2S0_MCLK_M0_PMIC (in), I2S0_SCLK_M0_PMIC (in), I2S0_LRCK_M0_PMIC (in), I2S0_SDO0_M0_PMIC (in), I2S0_SDI0_M0/PDM_SDI0_M0_PMIC (out), PDM_CLK0_M0_PMIC (in), I2C0_SCL_PMIC (in), PMIC_PWRON (in), PMIC_SLEEP_H (in), PMIC_EXT_EN (out)
SD/TF CARD = SD_TF-CARD.SchDoc: SDMMC0_D0, SDMMC0_D1, SDMMC0_D2, SDMMC0_D3, SDMMC0_CMD, SDMMC0_CLK (in), SDMMC0_DET_L (out)

### Ports
AUDIO-HP-L (out, see Controller-RK3562-TOP[6C], SPEAKER-MIC[1A]), AUDIO-HP-R (out, see Controller-RK3562-TOP[6C], SPEAKER-MIC[1A]), AUDIO-SD (out, see Controller-RK3562-TOP[6C], SPEAKER-MIC[1B]), BT_REG_ON_H (out, see Controller-RK3562-TOP[5C], RK3562-PMUIO-OSC-PLL[5C], WF-BT-AP6256[1A]), BT_WAKE_HOST_H (in, see Controller-RK3562-TOP[5C], RK3562-PMUIO-OSC-PLL[5C], WF-BT-AP6256[1A]), BUMPER-SW1 (in, see Controller-RK3562-TOP[5B], RK3562-VCCIO6[4C]), BUMPER-SW2 (in, see Controller-RK3562-TOP[5B], RK3562-VCCIO6[4C]), CAM_CLK0_OUT (out, see Controller-RK3562-TOP[6B], MIPI-CAMERA[1B], RK3562-VCCIO5[4D]), CAM_PDN0_L (out, see Controller-RK3562-TOP[6B], MIPI-CAMERA[1C], RK3562-VCCIO5[4D]), CAM_RST0_L (out, see Controller-RK3562-TOP[6B], MIPI-CAMERA[1B], RK3562-VCCIO5[4D]), HOST_WAKE_BT_H (out, see Controller-RK3562-TOP[5C], RK3562-PMUIO-OSC-PLL[5C], WF-BT-AP6256[1A]), I2C4_SCL_M0 (out, see Controller-RK3562-TOP[6B], MIPI-CAMERA[1B], RK3562-VCCIO5[4D]), I2C4_SDA_M0 (see Controller-RK3562-TOP[6B], MIPI-CAMERA[1B], RK3562-VCCIO5[4D]), I2S2_LRCK_M0 (out, see Controller-RK3562-TOP[5C], RK3562-VCCIO4[4B], WF-BT-AP6256[1A]), I2S2_SCLK_M0 (out, see Controller-RK3562-TOP[5C], RK3562-VCCIO4[4B], WF-BT-AP6256[1A]), I2S2_SDI_M0 (in, see Controller-RK3562-TOP[5C], RK3562-VCCIO4[4B], WF-BT-AP6256[1B]), I2S2_SDO_M0 (out, see Controller-RK3562-TOP[5C], RK3562-VCCIO4[4B], WF-BT-AP6256[1B]), IMU-CS (out, see Controller-RK3562-TOP[6C], RK3562-VCCIO6[4D]), IMU-FSYNC-RK (out, see Controller-RK3562-TOP[6C], RK3562-VCCIO6[4C]), IMU-INT#1-RK (in, see Controller-RK3562-TOP[6C], RK3562-VCCIO6[4C]), IMU-INT#2-RK (in, see Controller-RK3562-TOP[6C], RK3562-VCCIO6[4C]), IMU-MISO (in, see Controller-RK3562-TOP[6C], RK3562-VCCIO6[4C]), IMU-MOSI (out, see Controller-RK3562-TOP[6C], RK3562-VCCIO6[4C]), IMU-SCLK (out, see Controller-RK3562-TOP[6C], RK3562-VCCIO6[4D]), LiDAR-RXD (in, see Controller-RK3562-TOP[6B], LiDAR [1B]), LiDAR-TXD (out, see Controller-RK3562-TOP[6B]), MIC1_IN (in, see Controller-RK3562-TOP[6C], RK-POWER-SUPPLY[4A], SPEAKER-MIC[1C]), MIC2_IN (in, see Controller-RK3562-TOP[6C], RK-POWER-SUPPLY[4A], SPEAKER-MIC[1D]), MIPI_CSI_RX0_CLK0N (out, see Controller-RK3562-TOP[6B], MIPI-CAMERA[1B], RK3562-VCCIO5[2B]), MIPI_CSI_RX0_CLK0P (out, see Controller-RK3562-TOP[6B], MIPI-CAMERA[1B], RK3562-VCCIO5[2A]), MIPI_CSI_RX0_D0N (in, see Controller-RK3562-TOP[6B], MIPI-CAMERA[1B], RK3562-VCCIO5[2A]), MIPI_CSI_RX0_D0P (in, see Controller-RK3562-TOP[6B], MIPI-CAMERA[1B], RK3562-VCCIO5[2A]), MIPI_CSI_RX0_D1N (in, see Controller-RK3562-TOP[6B], MIPI-CAMERA[1B], RK3562-VCCIO5[2A]), MIPI_CSI_RX0_D1P (in, see Controller-RK3562-TOP[6B], MIPI-CAMERA[1B], RK3562-VCCIO5[2A]), MIPI_CSI_RX0_D2N (in, see Controller-RK3562-TOP[6B], MIPI-CAMERA[1B], RK3562-VCCIO5[2A]), MIPI_CSI_RX0_D2P (in, see Controller-RK3562-TOP[6B], MIPI-CAMERA[1B], RK3562-VCCIO5[2A]), MIPI_CSI_RX0_D3N (in, see Controller-RK3562-TOP[6B], MIPI-CAMERA[1B], RK3562-VCCIO5[2A]), MIPI_CSI_RX0_D3P (in, see Controller-RK3562-TOP[6B], MIPI-CAMERA[1B], RK3562-VCCIO5[2A]), PMIC_32KOUT_WIFI (out, see Controller-RK3562-TOP[5C], RK-POWER-SUPPLY[1A], WF-BT-AP6256[1B]), PMIC_EXT_EN (out, see Controller-RK3562-TOP[5C], BMS-SYSTEM-POWER[1D], RK-POWER-SUPPLY[1A]), PMIC_PWRON (in, see Controller-RK3562-TOP[5C], RK-POWER-SUPPLY[1A], STM32G070RBT6[2B]), RK-RESET (in, see Controller-RK3562-TOP[5B], STM32G070RBT6[2C]), SDIO_CLK (out, see Controller-RK3562-TOP[6C], RK3562-VCCIO4[4A], WF-BT-AP6256[1A]), SDIO_CMD (see Controller-RK3562-TOP[6C], RK3562-VCCIO4[4A], WF-BT-AP6256[1A]), SDIO_D0 (see Controller-RK3562-TOP[6C], RK3562-VCCIO4[4A], WF-BT-AP6256[1A]), SDIO_D1 (see Controller-RK3562-TOP[6C], RK3562-VCCIO4[4A], WF-BT-AP6256[1A]), SDIO_D2 (see Controller-RK3562-TOP[6C], RK3562-VCCIO4[4A], WF-BT-AP6256[1A]), SDIO_D3 (see Controller-RK3562-TOP[6C], RK3562-VCCIO4[4A], WF-BT-AP6256[1A]), SPK_N (out, see Controller-RK3562-TOP[6C], SPEAKER-MIC[3C]), SPK_P (out, see Controller-RK3562-TOP[6C], SPEAKER-MIC[3C]), STM-RESET (out, see Controller-RK3562-TOP[5B], RK3562-VCCIO6[4C], STM32G070RBT6[1A]), UART1_CTSn_M0 (out, see Controller-RK3562-TOP[5C], RK3562-VCCIO4[4B], WF-BT-AP6256[1A]), UART1_RTSn_M0 (in, see Controller-RK3562-TOP[5C], RK3562-VCCIO4[4B], WF-BT-AP6256[1A]), UART1_RX_M0 (out, see Controller-RK3562-TOP[6C], WF-BT-AP6256[1A]), UART1_TX_M0 (in, see Controller-RK3562-TOP[5C], WF-BT-AP6256[1A]), UART９_RX_M0 (in, see Controller-RK3562-TOP[5B]), UART９_TX_M0 (out, see Controller-RK3562-TOP[5B]), USBC_N (bidir, see Controller-RK3562-TOP[5C], BMS-SYSTEM-POWER[8B]), USBC_P (bidir, see Controller-RK3562-TOP[5C], BMS-SYSTEM-POWER[8B]), WIFI_PWREN_L (out, see Controller-RK3562-TOP[5C], WF-BT-AP6256[1B]), WIFI_REG_ON_H (out, see Controller-RK3562-TOP[6C], RK3562-PMUIO-OSC-PLL[5C], WF-BT-AP6256[1A]), WIFI_WAKE_HOST_H (in, see Controller-RK3562-TOP[6C], RK3562-PMUIO-OSC-PLL[5C], WF-BT-AP6256[1A])

### Nets
GND: J3.1 J3.4 J3.5
BT_REG_ON_H: port BT_REG_ON_H, sheet RK3562-PMUIO-OSC-PLL/BT_REG_ON_H
BT_WAKE_HOST_H: port BT_WAKE_HOST_H, sheet RK3562-PMUIO-OSC-PLL/BT_WAKE_HOST_H
CAM_CLK0_OUT: port CAM_CLK0_OUT, sheet RK3562-VCCIO5/CAM_CLK0_OUT
CAM_PDN0_L: port CAM_PDN0_L, sheet RK3562-VCCIO5/CAM_PDN0_L
CAM_PWREN_H: sheet RK3562-VCCIO5/CAM_PWREN0_H, sheet RK-PERIPHERAL-POWER/CAM_PWREN_H
CAM_RST0_L: port CAM_RST0_L, sheet RK3562-VCCIO5/CAM_RST0_L
eMMC_CLK: sheet eMMC/eMMC_CLK, sheet RK3562-VCCIO2-VCCIO3/eMMC_CLK
eMMC_CMD: sheet eMMC/eMMC_CMD, sheet RK3562-VCCIO2-VCCIO3/eMMC_CMD
eMMC_D0: sheet eMMC/eMMC_D0, sheet RK3562-VCCIO2-VCCIO3/eMMC_D0
eMMC_D1: sheet eMMC/eMMC_D1, sheet RK3562-VCCIO2-VCCIO3/eMMC_D1
eMMC_D2: sheet eMMC/eMMC_D2, sheet RK3562-VCCIO2-VCCIO3/eMMC_D2
eMMC_D3: sheet eMMC/eMMC_D3, sheet RK3562-VCCIO2-VCCIO3/eMMC_D3
eMMC_D4: sheet eMMC/eMMC_D4, sheet RK3562-VCCIO2-VCCIO3/eMMC_D4
eMMC_D5: sheet eMMC/eMMC_D5, sheet RK3562-VCCIO2-VCCIO3/eMMC_D5
eMMC_D6: sheet eMMC/eMMC_D6, sheet RK3562-VCCIO2-VCCIO3/eMMC_D6
eMMC_D7: sheet eMMC/eMMC_D7, sheet RK3562-VCCIO2-VCCIO3/eMMC_D7
eMMC_DATA_STROBE: sheet eMMC/eMMC_DATA_STROBE, sheet RK3562-VCCIO2-VCCIO3/eMMC_DATA_STROBE
HOST_WAKE_BT_H: port HOST_WAKE_BT_H, sheet RK3562-PMUIO-OSC-PLL/HOST_WAKE_BT_H
HPL_OUT: port AUDIO-HP-L, sheet RK-POWER-SUPPLY/HPL_OUT
HPR_OUT: port AUDIO-HP-R, sheet RK-POWER-SUPPLY/HPR_OUT
I2C0_SCL_PMIC: sheet RK3562-PMUIO-OSC-PLL/I2C0_SCL_PMIC, sheet RK-POWER-SUPPLY/I2C0_SCL_PMIC
I2C0_SDA_PMIC: sheet RK3562-PMUIO-OSC-PLL/I2C0_SDA_PMIC, sheet RK-POWER-SUPPLY/I2C0_SDA_PMIC
I2C4_SCL_M0: port I2C4_SCL_M0, sheet RK3562-VCCIO5/I2C4_SCL_M0
I2C4_SDA_M0: port I2C4_SDA_M0, sheet RK3562-VCCIO5/I2C4_SDA_M0
I2S0_LRCK_M0_PMIC: sheet RK3562-VCCIO1/I2S0_LRCK_M0_PMIC, sheet RK-POWER-SUPPLY/I2S0_LRCK_M0_PMIC
I2S0_MCLK_M0_PMIC: sheet RK3562-VCCIO1/I2S0_MCLK_M0_PMIC, sheet RK-POWER-SUPPLY/I2S0_MCLK_M0_PMIC
I2S0_SCLK_M0_PMIC: sheet RK3562-VCCIO1/I2S0_SCLK_M0_PMIC, sheet RK-POWER-SUPPLY/I2S0_SCLK_M0_PMIC
I2S0_SDI0_M0/PDM_SDI0_M0_PMIC: sheet RK3562-VCCIO1/I2S0_SDI0_M0/PDM_SDI0_M0_PMIC, sheet RK-POWER-SUPPLY/I2S0_SDI0_M0/PDM_SDI0_M0_PMIC
I2S0_SDO0_M0_PMIC: sheet RK3562-VCCIO1/I2S0_SDO0_M0_PMIC, sheet RK-POWER-SUPPLY/I2S0_SDO0_M0_PMIC
I2S2_LRCK_M0: port I2S2_LRCK_M0, sheet RK3562-VCCIO4/I2S2_LRCK_M0
I2S2_SCLK_M0: port I2S2_SCLK_M0, sheet RK3562-VCCIO4/I2S2_SCLK_M0
I2S2_SDI_M0: port I2S2_SDI_M0, sheet RK3562-VCCIO4/I2S2_SDI_M0
I2S2_SDO_M0: port I2S2_SDO_M0, sheet RK3562-VCCIO4/I2S2_SDO_M0
IMU-CS: port IMU-CS, sheet RK3562-VCCIO6/IMU-CS
IMU-FSYNC: port IMU-FSYNC-RK, sheet RK3562-VCCIO6/IMU-FSYNC-RK
IMU-INT1: port IMU-INT#1-RK, sheet RK3562-VCCIO6/IMU-INT#1-RK
IMU-INT2: port IMU-INT#2-RK, sheet RK3562-VCCIO6/IMU-INT#2-RK
IMU-MISO: port IMU-MISO, sheet RK3562-VCCIO6/IMU-MISO
IMU-MOSI: port IMU-MOSI, sheet RK3562-VCCIO6/IMU-MOSI
IMU-SCLK: port IMU-SCLK, sheet RK3562-VCCIO6/IMU-SCLK
LiDAR-TXD: port LiDAR-TXD, sheet RK3562-VCCIO6/UART4_TXD_M0
MIC1_IN: port MIC1_IN, sheet RK-POWER-SUPPLY/MIC1_IN
MIC2_IN: port MIC2_IN, sheet RK-POWER-SUPPLY/MIC2_IN
MIPI_CSI_RX0_CLK0_N: port MIPI_CSI_RX0_CLK0N, sheet RK3562-VCCIO5/MIPI_CSI_RX0_CLK0N
MIPI_CSI_RX0_CLK0_P: port MIPI_CSI_RX0_CLK0P, sheet RK3562-VCCIO5/MIPI_CSI_RX0_CLK0P
MIPI_CSI_RX0_D0_N: port MIPI_CSI_RX0_D0N, sheet RK3562-VCCIO5/MIPI_CSI_RX0_D0N
MIPI_CSI_RX0_D0_P: port MIPI_CSI_RX0_D0P, sheet RK3562-VCCIO5/MIPI_CSI_RX0_D0P
MIPI_CSI_RX0_D1_N: port MIPI_CSI_RX0_D1N, sheet RK3562-VCCIO5/MIPI_CSI_RX0_D1N
MIPI_CSI_RX0_D1_P: port MIPI_CSI_RX0_D1P, sheet RK3562-VCCIO5/MIPI_CSI_RX0_D1P
MIPI_CSI_RX0_D2_N: port MIPI_CSI_RX0_D2N, sheet RK3562-VCCIO5/MIPI_CSI_RX0_D2N
MIPI_CSI_RX0_D2_P: port MIPI_CSI_RX0_D2P, sheet RK3562-VCCIO5/MIPI_CSI_RX0_D2P
MIPI_CSI_RX0_D3_N: port MIPI_CSI_RX0_D3N, sheet RK3562-VCCIO5/MIPI_CSI_RX0_D3N
MIPI_CSI_RX0_D3_P: port MIPI_CSI_RX0_D3P, sheet RK3562-VCCIO5/MIPI_CSI_RX0_D3P
PDM_CLK0_M0_PMIC: sheet RK3562-VCCIO1/PDM_CLK0_M0_PMIC, sheet RK-POWER-SUPPLY/PDM_CLK0_M0_PMIC
PMIC_32KOUT_WIFI: port PMIC_32KOUT_WIFI, sheet RK-POWER-SUPPLY/PMIC_32KOUT_WIFI
PMIC_EXT_EN: port PMIC_EXT_EN, sheet RK-POWER-SUPPLY/PMIC_EXT_EN
PMIC_INT_L: sheet RK3562-PMUIO-OSC-PLL/PMIC_INT_L, sheet RK-POWER-SUPPLY/PMIC_INT_L
PMIC_PWRON: port PMIC_PWRON, sheet RK-POWER-SUPPLY/PMIC_PWRON
PMIC_SLEEP_H: sheet RK3562-PMUIO-OSC-PLL/PMIC_SLEEP_H, sheet RK-POWER-SUPPLY/PMIC_SLEEP_H
PWM_NPU: sheet RK3562-PMUIO-OSC-PLL/PWM_NPU, sheet RK-PERIPHERAL-POWER/PWM_NPU
RK-RESET: port RK-RESET, sheet RK3562-PMUIO-OSC-PLL/RESETn, sheet RK-POWER-SUPPLY/RESETn  [project net RESETn]
SD_TF-DET-L: sheet RK3562-PMUIO-OSC-PLL/SDMMC0_DET_L, sheet SD/TF CARD/SDMMC0_DET_L
SDIO_CLK: port SDIO_CLK, sheet RK3562-VCCIO4/SDIO_CLK
SDIO_CMD: port SDIO_CMD, sheet RK3562-VCCIO4/SDIO_CMD
SDIO_D0: port SDIO_D0, sheet RK3562-VCCIO4/SDIO_D0
SDIO_D1: port SDIO_D1, sheet RK3562-VCCIO4/SDIO_D1
SDIO_D2: port SDIO_D2, sheet RK3562-VCCIO4/SDIO_D2
SDIO_D3: port SDIO_D3, sheet RK3562-VCCIO4/SDIO_D3
SDMMC0_CLK: sheet RK3562-VCCIO2-VCCIO3/SDMMC0_CLK, sheet SD/TF CARD/SDMMC0_CLK
SDMMC0_CMD: sheet RK3562-VCCIO2-VCCIO3/SDMMC0_CMD, sheet SD/TF CARD/SDMMC0_CMD
SDMMC0_D0: sheet RK3562-VCCIO2-VCCIO3/SDMMC0_D0, sheet SD/TF CARD/SDMMC0_D0
SDMMC0_D1: sheet RK3562-VCCIO2-VCCIO3/SDMMC0_D1, sheet SD/TF CARD/SDMMC0_D1
SDMMC0_D2: sheet RK3562-VCCIO2-VCCIO3/SDMMC0_D2, sheet SD/TF CARD/SDMMC0_D2
SDMMC0_D3: sheet RK3562-VCCIO2-VCCIO3/SDMMC0_D3, sheet SD/TF CARD/SDMMC0_D3
SPKN_OUT: port SPK_N, sheet RK-POWER-SUPPLY/SPKN_OUT
SPKP_OUT: port SPK_P, sheet RK-POWER-SUPPLY/SPKP_OUT
STM32-RST: port STM-RESET, sheet RK3562-VCCIO6/STM-RESET
UART1_CTSn_M0: port UART1_CTSn_M0, sheet RK3562-VCCIO4/UART1_CTSn_M0
UART1_RTSn_M0: port UART1_RTSn_M0, sheet RK3562-VCCIO4/UART1_RTSn_M0
UART1_RX_M0: port UART1_RX_M0, sheet RK3562-VCCIO4/UART1_TX_M0
UART1_TX_M0: port UART1_TX_M0, sheet RK3562-VCCIO4/UART1_RX_M0
UART4_RXD_M0: port LiDAR-RXD, sheet RK3562-VCCIO6/UART4_RXD_M0
UART9_RXD_M0: port UART９_RX_M0, sheet RK3562-VCCIO6/UART9_RXD_M0
UART9_TXD_M0: port UART９_TX_M0, sheet RK3562-VCCIO6/UART9_TXD_M0
WIFI_PWREN_L: port WIFI_PWREN_L, sheet RK3562-PMUIO-OSC-PLL/WIFI_PWR
WIFI_REG_ON_H: port WIFI_REG_ON_H, sheet RK3562-PMUIO-OSC-PLL/WIFI_REG_ON_H
WIFI_WAKE_HOST_H: port WIFI_WAKE_HOST_H, sheet RK3562-PMUIO-OSC-PLL/WIFI_WAKE_HOST_H
NetC3001_1: sheet RK3562-DDR-PHY/LPDDR4_RESETn, sheet DRAM-LPDDR4/LPDDR4_RESETn
NetJ2_3: port USBC_P, sheet RK3562-USB-PCIe-PHY/USB20_OTG_DP
NetJ2_4: port USBC_N, sheet RK3562-USB-PCIe-PHY/USB20_OTG_DM
NetJ3_2: J3.2 ; sheet RK3562-PMUIO-OSC-PLL/UART0_RX_M0_DEBUG
NetJ3_3: J3.3 ; sheet RK3562-PMUIO-OSC-PLL/UART0_TX_M0_DEBUG
NetU1000_1A1: sheet RK3562-DDR-PHY/LPDDR4_DQS1P_A, sheet DRAM-LPDDR4/LPDDR4_DQS1P_A
NetU1000_1A3: sheet RK3562-DDR-PHY/LPDDR4_DQS0P_A, sheet DRAM-LPDDR4/LPDDR4_DQS0P_A
NetU1000_1A6: sheet RK3562-DDR-PHY/LPDDR4_A3_A, sheet DRAM-LPDDR4/LPDDR4_A3_A
NetU1000_1A7: sheet RK3562-DDR-PHY/LPDDR4_A5_A, sheet DRAM-LPDDR4/LPDDR4_A5_A
NetU1000_1A8: sheet RK3562-DDR-PHY/LPDDR4_A5_B, sheet DRAM-LPDDR4/LPDDR4_A5_B
NetU1000_1A9: sheet RK3562-DDR-PHY/LPDDR4_A4_B, sheet DRAM-LPDDR4/LPDDR4_A4_B
NetU1000_1A10: sheet RK3562-DDR-PHY/LPDDR4_A3_B, sheet DRAM-LPDDR4/LPDDR4_A3_B
NetU1000_1A13: sheet RK3562-DDR-PHY/LPDDR4_DQS0P_B, sheet DRAM-LPDDR4/LPDDR4_DQS0P_B
NetU1000_1A15: sheet RK3562-DDR-PHY/LPDDR4_DQS1P_B, sheet DRAM-LPDDR4/LPDDR4_DQS1P_B
NetU1000_1B1: sheet RK3562-DDR-PHY/LPDDR4_DQS1N_A, sheet DRAM-LPDDR4/LPDDR4_DQS1N_A
NetU1000_1B3: sheet RK3562-DDR-PHY/LPDDR4_DQS0N_A, sheet DRAM-LPDDR4/LPDDR4_DQS0N_A
NetU1000_1B8: sheet RK3562-DDR-PHY/LPDDR4_A4_A, sheet DRAM-LPDDR4/LPDDR4_A4_A
NetU1000_1B13: sheet RK3562-DDR-PHY/LPDDR4_DQS0N_B, sheet DRAM-LPDDR4/LPDDR4_DQS0N_B
NetU1000_1B15: sheet RK3562-DDR-PHY/LPDDR4_DQS1N_B, sheet DRAM-LPDDR4/LPDDR4_DQS1N_B
NetU1000_A2: sheet RK3562-DDR-PHY/LPDDR4_DM1_A, sheet DRAM-LPDDR4/LPDDR4_DM1_A
NetU1000_A3: sheet RK3562-DDR-PHY/LPDDR4_DQ14_A, sheet DRAM-LPDDR4/LPDDR4_DQ14_A
NetU1000_A4: sheet RK3562-DDR-PHY/LPDDR4_DQ12_A, sheet DRAM-LPDDR4/LPDDR4_DQ12_A
NetU1000_A6: sheet RK3562-DDR-PHY/LPDDR4_DQ6_A, sheet DRAM-LPDDR4/LPDDR4_DQ6_A
NetU1000_A8: sheet RK3562-DDR-PHY/LPDDR4_DQ2_A, sheet DRAM-LPDDR4/LPDDR4_DQ2_A
NetU1000_A10: sheet RK3562-DDR-PHY/LPDDR4_A1_A, sheet DRAM-LPDDR4/LPDDR4_A1_A
NetU1000_A13: sheet RK3562-DDR-PHY/LPDDR4_CLKN_A, sheet DRAM-LPDDR4/LPDDR4_CLKN_A
NetU1000_A15: sheet RK3562-DDR-PHY/LPDDR4_CLKN_B, sheet DRAM-LPDDR4/LPDDR4_CLKN_B
NetU1000_A18: sheet RK3562-DDR-PHY/LPDDR4_A1_B, sheet DRAM-LPDDR4/LPDDR4_A1_B
NetU1000_A20: sheet RK3562-DDR-PHY/LPDDR4_DQ2_B, sheet DRAM-LPDDR4/LPDDR4_DQ2_B
NetU1000_A22: sheet RK3562-DDR-PHY/LPDDR4_DQ7_B, sheet DRAM-LPDDR4/LPDDR4_DQ7_B
NetU1000_A24: sheet RK3562-DDR-PHY/LPDDR4_DQ12_B, sheet DRAM-LPDDR4/LPDDR4_DQ12_B
NetU1000_A25: sheet RK3562-DDR-PHY/LPDDR4_DQ14_B, sheet DRAM-LPDDR4/LPDDR4_DQ14_B
NetU1000_A26: sheet RK3562-DDR-PHY/LPDDR4_DM1_B, sheet DRAM-LPDDR4/LPDDR4_DM1_B
NetU1000_AB3: port AUDIO-SD, sheet RK3562-VCCIO6/SPK_STL
NetU1000_B1: sheet RK3562-DDR-PHY/LPDDR4_DQ10_A, sheet DRAM-LPDDR4/LPDDR4_DQ10_A
NetU1000_B2: sheet RK3562-DDR-PHY/LPDDR4_DQ11_A, sheet DRAM-LPDDR4/LPDDR4_DQ11_A
NetU1000_B3: sheet RK3562-DDR-PHY/LPDDR4_DQ15_A, sheet DRAM-LPDDR4/LPDDR4_DQ15_A
NetU1000_B4: sheet RK3562-DDR-PHY/LPDDR4_DQ13_A, sheet DRAM-LPDDR4/LPDDR4_DQ13_A
NetU1000_B5: sheet RK3562-DDR-PHY/LPDDR4_DQ5_A, sheet DRAM-LPDDR4/LPDDR4_DQ5_A
NetU1000_B6: sheet RK3562-DDR-PHY/LPDDR4_DQ0_A, sheet DRAM-LPDDR4/LPDDR4_DQ0_A
NetU1000_B7: sheet RK3562-DDR-PHY/LPDDR4_DM0_A, sheet DRAM-LPDDR4/LPDDR4_DM0_A
NetU1000_B8: sheet RK3562-DDR-PHY/LPDDR4_DQ1_A, sheet DRAM-LPDDR4/LPDDR4_DQ1_A
NetU1000_B10: sheet RK3562-DDR-PHY/LPDDR4_A0_A, sheet DRAM-LPDDR4/LPDDR4_A0_A
NetU1000_B11: sheet RK3562-DDR-PHY/LPDDR4_CS0n_A, sheet DRAM-LPDDR4/LPDDR4_CS0n_A
NetU1000_B12: sheet RK3562-DDR-PHY/LPDDR4_CKE1_A, sheet DRAM-LPDDR4/LPDDR4_CKE1_A
NetU1000_B13: sheet RK3562-DDR-PHY/LPDDR4_CLKP_A, sheet DRAM-LPDDR4/LPDDR4_CLKP_A
NetU1000_B15: sheet RK3562-DDR-PHY/LPDDR4_CLKP_B, sheet DRAM-LPDDR4/LPDDR4_CLKP_B
NetU1000_B16: sheet RK3562-DDR-PHY/LPDDR4_CKE1_B, sheet DRAM-LPDDR4/LPDDR4_CKE1_B
NetU1000_B17: sheet RK3562-DDR-PHY/LPDDR4_CS0n_B, sheet DRAM-LPDDR4/LPDDR4_CS0n_B
NetU1000_B18: sheet RK3562-DDR-PHY/LPDDR4_A0_B, sheet DRAM-LPDDR4/LPDDR4_A0_B
NetU1000_B20: sheet RK3562-DDR-PHY/LPDDR4_DQ1_B, sheet DRAM-LPDDR4/LPDDR4_DQ1_B
NetU1000_B21: sheet RK3562-DDR-PHY/LPDDR4_DM0_B, sheet DRAM-LPDDR4/LPDDR4_DM0_B
NetU1000_B22: sheet RK3562-DDR-PHY/LPDDR4_DQ0_B, sheet DRAM-LPDDR4/LPDDR4_DQ0_B
NetU1000_B23: sheet RK3562-DDR-PHY/LPDDR4_DQ5_B, sheet DRAM-LPDDR4/LPDDR4_DQ5_B
NetU1000_B24: sheet RK3562-DDR-PHY/LPDDR4_DQ13_B, sheet DRAM-LPDDR4/LPDDR4_DQ13_B
NetU1000_B25: sheet RK3562-DDR-PHY/LPDDR4_DQ15_B, sheet DRAM-LPDDR4/LPDDR4_DQ15_B
NetU1000_B26: sheet RK3562-DDR-PHY/LPDDR4_DQ11_B, sheet DRAM-LPDDR4/LPDDR4_DQ11_B
NetU1000_B27: sheet RK3562-DDR-PHY/LPDDR4_DQ10_B, sheet DRAM-LPDDR4/LPDDR4_DQ10_B
NetU1000_C1: sheet RK3562-DDR-PHY/LPDDR4_DQ9_A, sheet DRAM-LPDDR4/LPDDR4_DQ9_A
NetU1000_C2: sheet RK3562-DDR-PHY/LPDDR4_DQ8_A, sheet DRAM-LPDDR4/LPDDR4_DQ8_A
NetU1000_C5: sheet RK3562-DDR-PHY/LPDDR4_DQ4_A, sheet DRAM-LPDDR4/LPDDR4_DQ4_A
NetU1000_C6: sheet RK3562-DDR-PHY/LPDDR4_DQ7_A, sheet DRAM-LPDDR4/LPDDR4_DQ7_A
NetU1000_C8: sheet RK3562-DDR-PHY/LPDDR4_DQ3_A, sheet DRAM-LPDDR4/LPDDR4_DQ3_A
NetU1000_C10: sheet RK3562-DDR-PHY/LPDDR4_A2_A, sheet DRAM-LPDDR4/LPDDR4_A2_A
NetU1000_C11: sheet RK3562-DDR-PHY/LPDDR4_CS1n_A, sheet DRAM-LPDDR4/LPDDR4_CS1n_A
NetU1000_C12: sheet RK3562-DDR-PHY/LPDDR4_CKE0_A, sheet DRAM-LPDDR4/LPDDR4_CKE0_A
NetU1000_C16: sheet RK3562-DDR-PHY/LPDDR4_CKE0_B, sheet DRAM-LPDDR4/LPDDR4_CKE0_B
NetU1000_C17: sheet RK3562-DDR-PHY/LPDDR4_CS1n_B, sheet DRAM-LPDDR4/LPDDR4_CS1n_B
NetU1000_C18: sheet RK3562-DDR-PHY/LPDDR4_A2_B, sheet DRAM-LPDDR4/LPDDR4_A2_B
NetU1000_C20: sheet RK3562-DDR-PHY/LPDDR4_DQ3_B, sheet DRAM-LPDDR4/LPDDR4_DQ3_B
NetU1000_C22: sheet RK3562-DDR-PHY/LPDDR4_DQ6_B, sheet DRAM-LPDDR4/LPDDR4_DQ6_B
NetU1000_C23: sheet RK3562-DDR-PHY/LPDDR4_DQ4_B, sheet DRAM-LPDDR4/LPDDR4_DQ4_B
NetU1000_C26: sheet RK3562-DDR-PHY/LPDDR4_DQ8_B, sheet DRAM-LPDDR4/LPDDR4_DQ8_B
NetU1000_C27: sheet RK3562-DDR-PHY/LPDDR4_DQ9_B, sheet DRAM-LPDDR4/LPDDR4_DQ9_B
NetU1000_W2: port BUMPER-SW2, sheet RK3562-VCCIO6/BUMPER-SW2
NetU1000_Y2: port BUMPER-SW1, sheet RK3562-VCCIO6/BUMPER-SW1

### Notes on the sheet
- Controller-RK3562
- RK3562-VCCIO1
- RK3562-VCCIO2-VCCIO3
- eMMC
- RK3562-PMUIO-OSC-PLL
- RK3562-DDR-PHY
- SD_TF-CARD
- CHA
- RK3562-VCCIO4
- CHB
- RK3562-VCCIO5
- RK-PMIC-CODEC
- LPDDR4
- RK3562-VCCIO6
- RK3562-USB-PCIe-PHY
- RK-PERIPH-POER
- RK3562-POWER-GND

### Library data of the parts
J3 = HDRx3: ManufacturingPartNumber: *; Manufacturer: *; SupplierPartNumber: *; Supplier: *; VoltageRate: *

## Sheet eMMC.SchDoc
size 297 x 209 mm; SheetNumber: 14; SheetTotal: 32
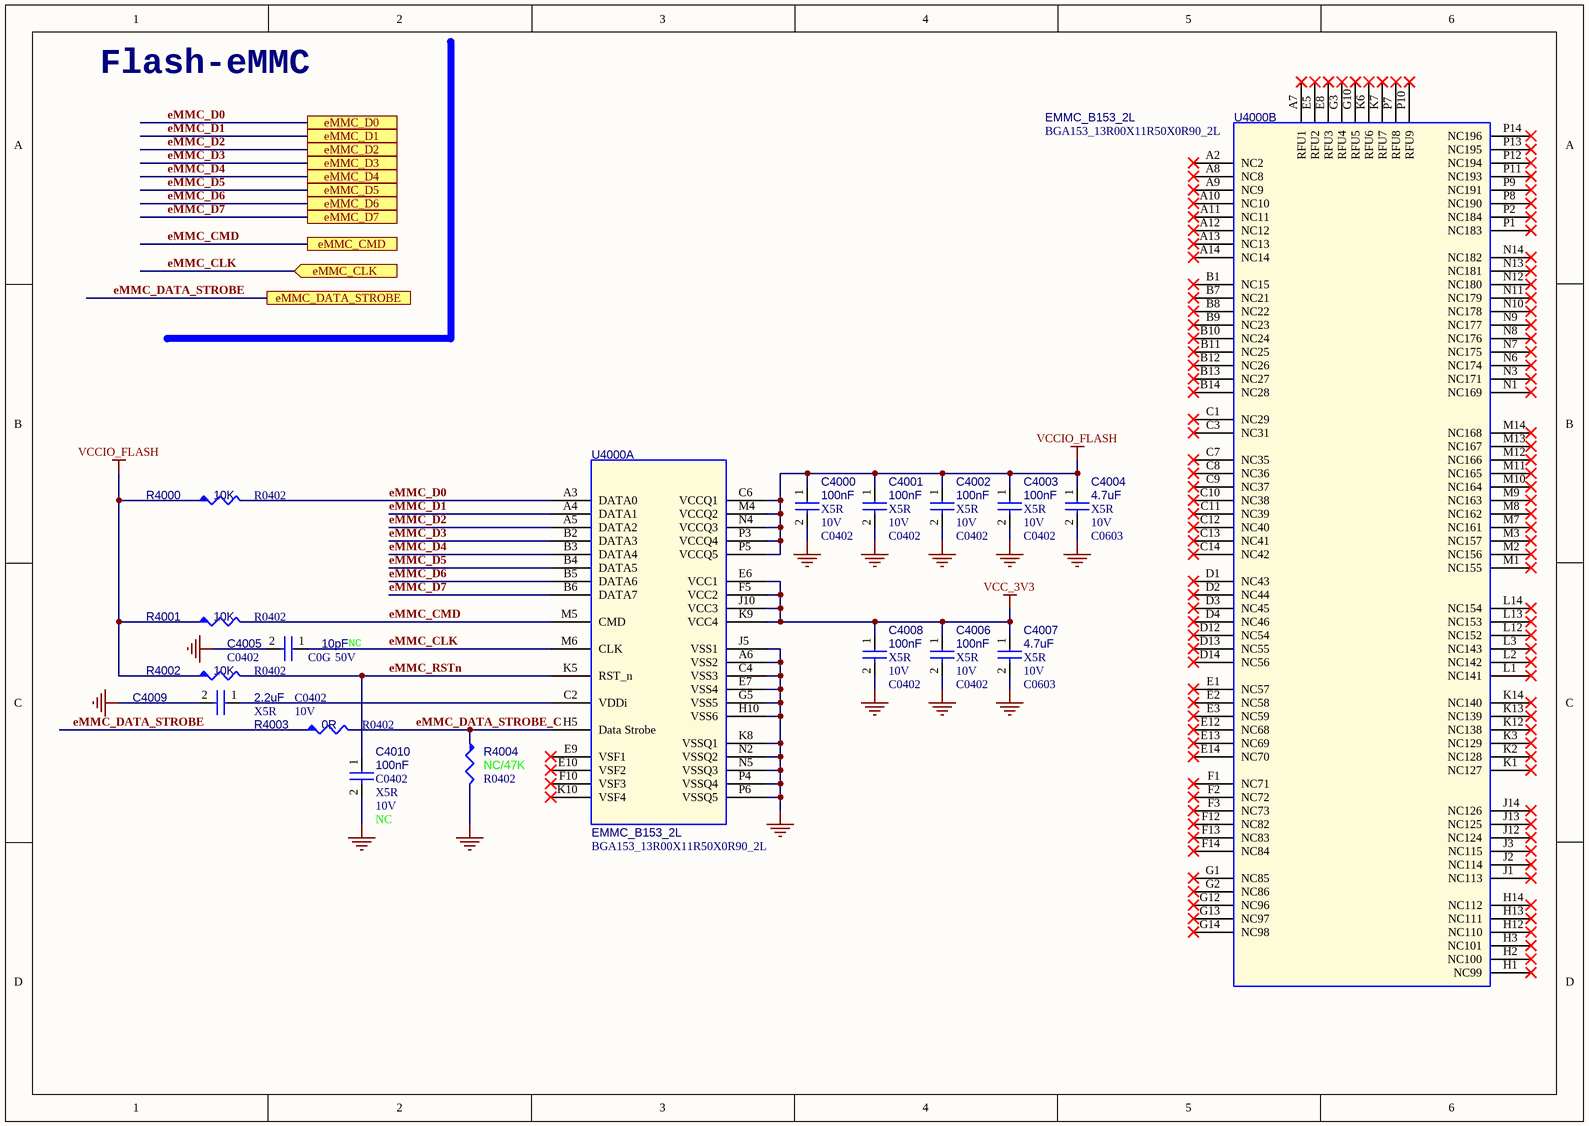
[diagram p4: eMMC.SchDoc]

### Parts
C4000  100nF  Dielectric: X5R  Voltage: 10V  [C0402]
C4001  100nF  Dielectric: X5R  Voltage: 10V  [C0402]
C4002  100nF  Dielectric: X5R  Voltage: 10V  [C0402]
C4003  100nF  Dielectric: X5R  Voltage: 10V  [C0402]
C4004  4.7uF  Dielectric: X5R  Voltage: 10V  [C0603]
C4005  10pF  Dielectric: C0G  Voltage: 50V  option: NC  [C0402]
C4006  100nF  Dielectric: X5R  Voltage: 10V  [C0402]
C4007  4.7uF  Dielectric: X5R  Voltage: 10V  [C0603]
C4008  100nF  Dielectric: X5R  Voltage: 10V  [C0402]
C4009  2.2uF  Dielectric: X5R  Voltage: 10V  [C0402]
C4010  100nF  Dielectric: X5R  Voltage: 10V  option: NC  [C0402]
R4000  10K  [R0402]
R4001  10K  [R0402]
R4002  10K  [R0402]
R4003  0R  [R0402]
R4004  NC/47K  [R0402]
U4000  EMMC_B153_2L  PCB Footprint: BGA153_13R00X11R50X0R90_2L  [FBGA-153_L13.0-W11.5-P0.50_KLMAG1JETD-B041]  (parts A,B of 2)

### Ports
eMMC_CLK (in, see CONTROLLER-RK3562[3A], RK3562-VCCIO2-VCCIO3[3B]), eMMC_CMD (see CONTROLLER-RK3562[3A], RK3562-VCCIO2-VCCIO3[3A]), eMMC_D0 (see CONTROLLER-RK3562[3A], RK3562-VCCIO2-VCCIO3[3A]), eMMC_D1 (see CONTROLLER-RK3562[3A], RK3562-VCCIO2-VCCIO3[3A]), eMMC_D2 (see CONTROLLER-RK3562[3A], RK3562-VCCIO2-VCCIO3[3A]), eMMC_D3 (see CONTROLLER-RK3562[3A], RK3562-VCCIO2-VCCIO3[3A]), eMMC_D4 (see CONTROLLER-RK3562[3A], RK3562-VCCIO2-VCCIO3[3A]), eMMC_D5 (see CONTROLLER-RK3562[3A], RK3562-VCCIO2-VCCIO3[3A]), eMMC_D6 (see CONTROLLER-RK3562[3A], RK3562-VCCIO2-VCCIO3[3A]), eMMC_D7 (see CONTROLLER-RK3562[3A], RK3562-VCCIO2-VCCIO3[3A]), eMMC_DATA_STROBE (see CONTROLLER-RK3562[3A], RK3562-VCCIO2-VCCIO3[3B])

### Nets
GND: C4000.2 C4001.2 C4002.2 C4003.2 C4004.2 C4005.2 C4006.2 C4007.2 C4008.2 C4009.2 C4010.2 R4004.2 U4000.A6(VSS2) U4000.C4(VSS3) U4000.E7(VSS4) U4000.G5(VSS5) U4000.H10(VSS6) U4000.J5(VSS1) U4000.K8(VSSQ1) U4000.N2(VSSQ2) U4000.N5(VSSQ3) U4000.P4(VSSQ4) U4000.P6(VSSQ5)
VCC_3V3: C4006.1 C4007.1 C4008.1 U4000.E6(VCC1) U4000.F5(VCC2) U4000.J10(VCC3) U4000.K9(VCC4)
VCCIO_FLASH: C4000.1 C4001.1 C4002.1 C4003.1 C4004.1 R4000.1 R4001.1 R4002.1 U4000.C6(VCCQ1) U4000.M4(VCCQ2) U4000.N4(VCCQ3) U4000.P3(VCCQ4) U4000.P5(VCCQ5)
eMMC_CLK: C4005.1 U4000.M6(CLK) ; port eMMC_CLK
eMMC_CMD: R4001.2 U4000.M5(CMD) ; port eMMC_CMD
eMMC_D0: R4000.2 U4000.A3(DATA0) ; port eMMC_D0
eMMC_D1: U4000.A4(DATA1) ; port eMMC_D1
eMMC_D2: U4000.A5(DATA2) ; port eMMC_D2
eMMC_D3: U4000.B2(DATA3) ; port eMMC_D3
eMMC_D4: U4000.B3(DATA4) ; port eMMC_D4
eMMC_D5: U4000.B4(DATA5) ; port eMMC_D5
eMMC_D6: U4000.B5(DATA6) ; port eMMC_D6
eMMC_D7: U4000.B6(DATA7) ; port eMMC_D7
eMMC_DATA_STROBE: R4003.1 ; port eMMC_DATA_STROBE
eMMC_DATA_STROBE_C: R4003.2 R4004.1 U4000.H5(Data_Strobe)
eMMC_RSTn: C4010.1 R4002.2 U4000.K5(RST_n)
NetC4009_1: C4009.1 U4000.C2(VDDi)

Not connected (* = marked no-connect by the designer): U4000 A2(NC2)* A7(RFU1)* A8(NC8)* A9(NC9)* A10(NC10)* A11(NC11)* A12(NC12)* A13(NC13)* A14(NC14)* B1(NC15)* B7(NC21)* B8(NC22)* B9(NC23)* B10(NC24)* B11(NC25)* B12(NC26)* B13(NC27)* B14(NC28)* C1(NC29)* C3(NC31)* C7(NC35)* C8(NC36)* C9(NC37)* C10(NC38)* C11(NC39)* C12(NC40)* C13(NC41)* C14(NC42)* D1(NC43)* D2(NC44)* D3(NC45)* D4(NC46)* D12(NC54)* D13(NC55)* D14(NC56)* E1(NC57)* E2(NC58)* E3(NC59)* E5(RFU2)* E8(RFU3)* E9(VSF1)* E10(VSF2)* E12(NC68)* E13(NC69)* E14(NC70)* F1(NC71)* F2(NC72)* F3(NC73)* F10(VSF3)* F12(NC82)* F13(NC83)* F14(NC84)* G1(NC85)* G2(NC86)* G3(RFU4)* G10(RFU5)* G12(NC96)* G13(NC97)* G14(NC98)* H1(NC99)* H2(NC100)* H3(NC101)* H12(NC110)* H13(NC111)* H14(NC112)* J1(NC113)* J2(NC114)* J3(NC115)* J12(NC124)* J13(NC125)* J14(NC126)* K1(NC127)* K2(NC128)* K3(NC129)* K6(RFU6)* K7(RFU7)* K10(VSF4)* K12(NC138)* K13(NC139)* K14(NC140)* L1(NC141)* L2(NC142)* L3(NC143)* L12(NC152)* L13(NC153)* L14(NC154)* M1(NC155)* M2(NC156)* M3(NC157)* M7(NC161)* M8(NC162)* M9(NC163)* M10(NC164)* M11(NC165)* M12(NC166)* M13(NC167)* M14(NC168)* N1(NC169)* N3(NC171)* N6(NC174)* N7(NC175)* N8(NC176)* N9(NC177)* N10(NC178)* N11(NC179)* N12(NC180)* N13(NC181)* N14(NC182)* P1(NC183)* P2(NC184)* P7(RFU8)* P8(NC190)* P9(NC191)* P10(RFU9)* P11(NC193)* P12(NC194)* P13(NC195)* P14(NC196)*

### Notes on the sheet
- Flash-eMMC

### Library data of the parts
C4000 = CAP NP: cap,100.00nF,+/-10%,10V,X5R,C0402; Part Reference: C4000; Manufacturer PN: C1005X5R1A104K050BA; Manufacturer: TDK; Tolerance: 10%; Priority: A; PCB Footprint: C0402; Value: 100nF; Created by: JJJ; Part Type: C0402; RK PN: C1005X5R1A104K050BA; ClassName: RK
C4001 = CAP NP: cap,100.00nF,+/-10%,10V,X5R,C0402; Part Reference: C4001; Manufacturer: TDK; RK PN: C1005X5R1A104K050BA; Priority: A; Tolerance: 10%; PCB Footprint: C0402; Value: 100nF; Part Type: C0402; Manufacturer PN: C1005X5R1A104K050BA; Created by: JJJ; ClassName: RK
C4002 = CAP NP: cap,100.00nF,+/-10%,10V,X5R,C0402; Part Reference: C4002; Manufacturer: TDK; RK PN: C1005X5R1A104K050BA; Priority: A; Tolerance: 10%; PCB Footprint: C0402; Value: 100nF; Part Type: C0402; Manufacturer PN: C1005X5R1A104K050BA; Created by: JJJ; ClassName: RK
C4003 = CAP NP: cap,100.00nF,+/-10%,10V,X5R,C0402; Part Reference: C4003; Manufacturer PN: C1005X5R1A104K050BA; Manufacturer: TDK; Tolerance: 10%; Priority: A; PCB Footprint: C0402; Value: 100nF; Created by: JJJ; Part Type: C0402; RK PN: C1005X5R1A104K050BA; ClassName: RK
C4004 = CAP NP: cap,4.70uF,+/-10%,10V,X5R,C0603; Part Reference: C4004; Manufacturer: TDK; Number: 37; RK PN: C1608X5R1A475K080AC; Priority: A; Tolerance: 10%; C_Voltage: 6.3V; PCB Footprint: C0603; Value: 4.7uF; Part Type: C0603; Manufacturer PN: C1608X5R1A475K080AC; Created by: JJJ; ClassName: RK
C4005 = CAP NP: cap,10.00pF,+/-0.5,50V,C0G,C0402; Part Reference: C4005; Manufacturer: TDK; RK PN: C1005C0G1H100D050BA; Priority: A; Tolerance: +/-0.5pF; PCB Footprint: C0402; Value: 10pF; Part Type: C0402; Manufacturer PN: C1005C0G1H100D050BA; Created by: JJJ; ClassName: RK
C4006 = CAP NP: cap,100.00nF,+/-10%,10V,X5R,C0402; Part Reference: C4006; Manufacturer PN: C1005X5R1A104K050BA; Manufacturer: TDK; Tolerance: 10%; Priority: A; PCB Footprint: C0402; Value: 100nF; Created by: JJJ; Part Type: C0402; RK PN: C1005X5R1A104K050BA; ClassName: RK
C4007 = CAP NP: cap,4.70uF,+/-10%,10V,X5R,C0603; Part Reference: C4007; Manufacturer: TDK; Number: 37; RK PN: C1608X5R1A475K080AC; Priority: A; Tolerance: 10%; C_Voltage: 6.3V; PCB Footprint: C0603; Value: 4.7uF; Part Type: C0603; Manufacturer PN: C1608X5R1A475K080AC; Created by: JJJ; ClassName: RK
C4008 = CAP NP: cap,100.00nF,+/-10%,10V,X5R,C0402; Part Reference: C4008; Manufacturer PN: C1005X5R1A104K050BA; Manufacturer: TDK; Tolerance: 10%; Priority: A; PCB Footprint: C0402; Value: 100nF; Created by: JJJ; Part Type: C0402; RK PN: C1005X5R1A104K050BA; ClassName: RK
C4009 = CAP NP: cap,2.20uF,+/-10%,10V,X5R,C0402; Part Reference: C4009; Manufacturer: TDK; RK PN: C1005X5R1A225K050BC; Priority: A; Tolerance: 10%; PCB Footprint: C0402; Value: 2.2uF; Part Type: C0402; Manufacturer PN: C1005X5R1A225K050BC; Created by: JJJ; ClassName: RK
C4010 = CAP NP: cap,100.00nF,+/-10%,10V,X5R,C0402; Part Reference: C4010; Manufacturer PN: C1005X5R1A104K050BA; Manufacturer: TDK; Tolerance: 10%; Priority: A; PCB Footprint: C0402; Value: 100nF; Created by: JJJ; Part Type: C0402; RK PN: C1005X5R1A104K050BA; ClassName: RK
R4000 = RESISTOR5: 通用厚膜电阻,10K,+/-5%,R0402,1/16W.; Part Reference: R4000; Manufacturer PN: RC0402JR-0710KL; Manufacturer: YAGEO; Tolerance: 5%; Wattage: 1/16W; Priority: A; RK PN: 901001449; PCB Footprint: R0402; Value: 10K; Created by: YTL; Part Type: 通用厚膜电阻; ClassName: RK
R4001 = RESISTOR5: 通用厚膜电阻,10K,+/-5%,R0402,1/16W.; Part Reference: R4001; Manufacturer PN: RC0402JR-0710KL; Manufacturer: YAGEO; Tolerance: 5%; Wattage: 1/16W; Priority: A; RK PN: 901001449; PCB Footprint: R0402; Value: 10K; Created by: YTL; Part Type: 通用厚膜电阻; ClassName: RK
R4002 = RESISTOR5: 通用厚膜电阻,10K,+/-5%,R0402,1/16W.; Part Reference: R4002; Manufacturer PN: RC0402JR-0710KL; Manufacturer: YAGEO; Tolerance: 5%; Wattage: 1/16W; Priority: A; RK PN: 901001449; PCB Footprint: R0402; Value: 10K; Created by: YTL; Part Type: 通用厚膜电阻; ClassName: RK
R4003 = RESISTOR5: 通用厚膜电阻,0R,+/-5%,R0402,1/16W.; Part Reference: R4003; Manufacturer PN: RC0402JR-070RL; Manufacturer: YAGEO; Tolerance: 5%; Wattage: 1/16W; Priority: A; RK PN: 901001446; PCB Footprint: R0402; Value: 0R; Created by: YTL; Part Type: 通用厚膜电阻; ClassName: RK
R4004 = RESISTOR5_NC: 通用厚膜电阻,47K,+/-5%,R0402,1/16W.; Part Reference: R4004; Manufacturer: YAGEO; Manufacturer PN: RC0402JR-0747KL; Tolerance: 5%; RK PN: 901001559-1; Priority: A; Wattage: 1/16W; Optional: X; PCB Footprint: R0402; Value: NC/47K; Part Type: 通用厚膜电阻; Created by: YTL; ClassName: RK
U4000 = INAND_EMMC_153_2L: EMMC_B153_2L,更好的满足工艺需求，Fanout方式部分走线跨接再球位上，挖除A1\C5球位; Part Reference: U4000; Priority: A; Value: EMMC_B153_2L; Created by: YWQ; Part Type: NAND_FLASH; RK PN: EMMC_B153_2L; ClassName: RK